# EasyEDA Pro project Revised_Schematic.epro

# Schematic Revised_Schematic_20261008

## Sheets
1 02_Power_Rails
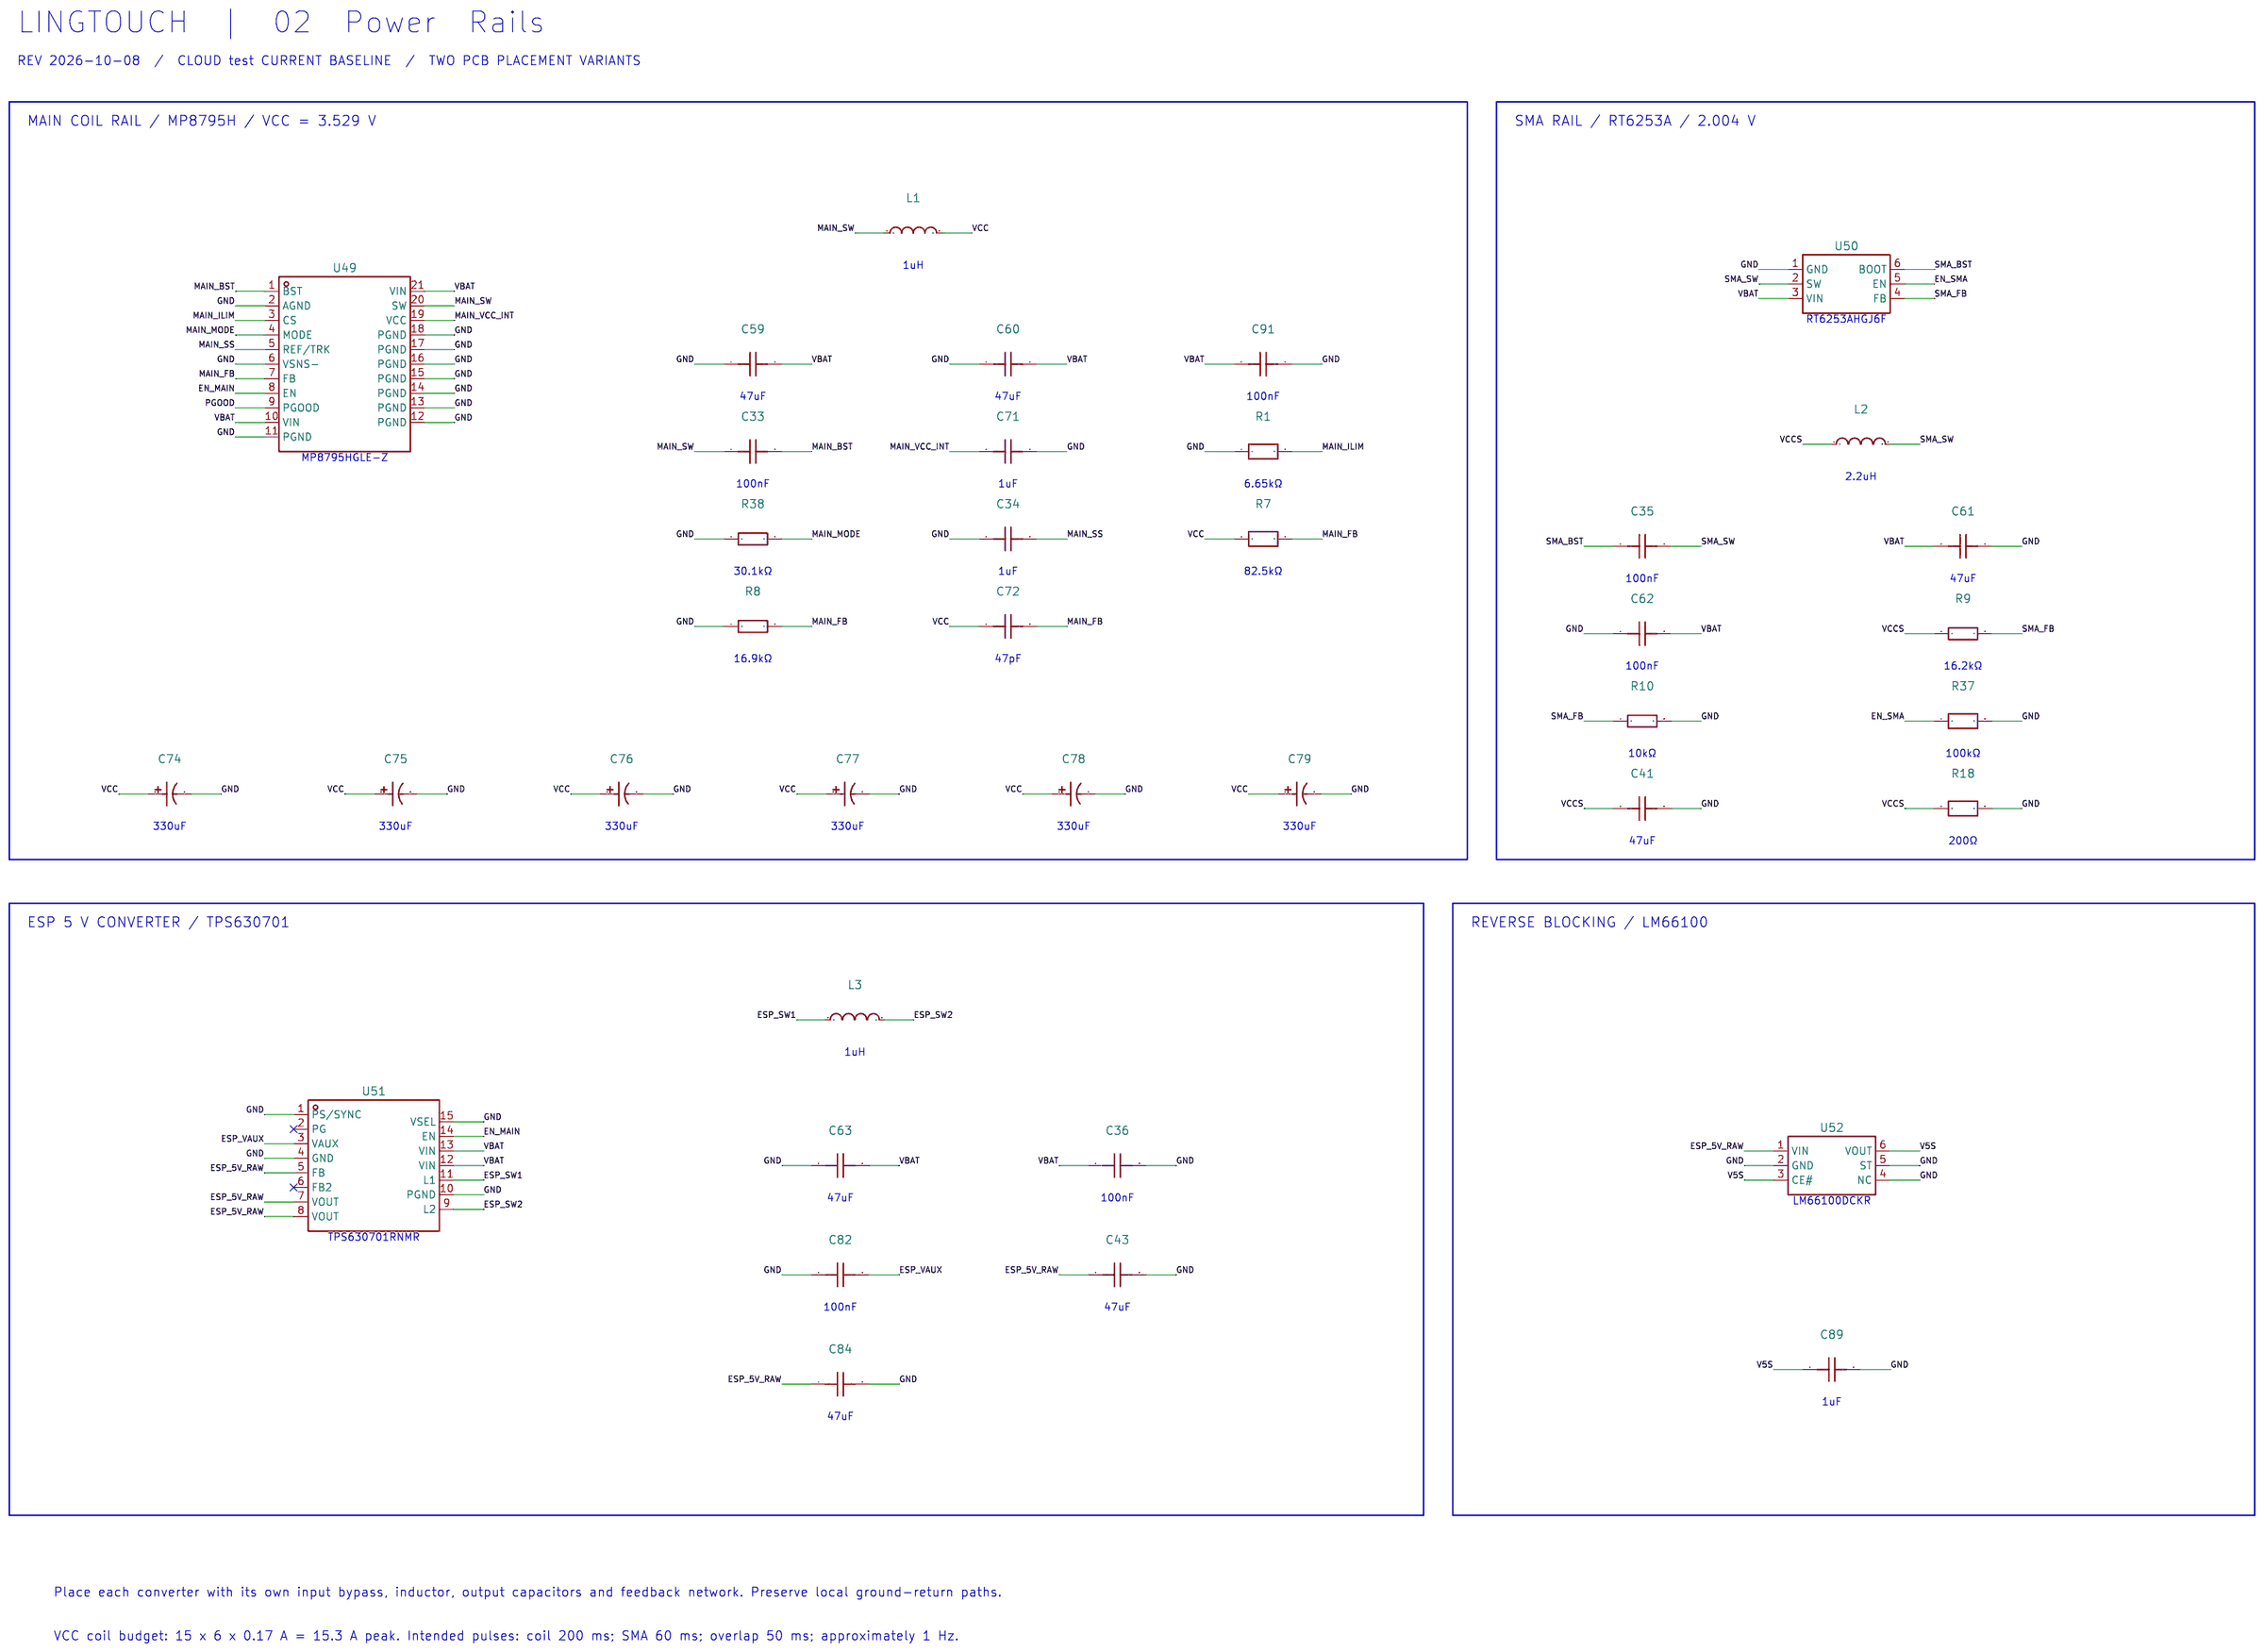
[diagram p0: 02_Power_Rails]
2 04_Drivers_01_08
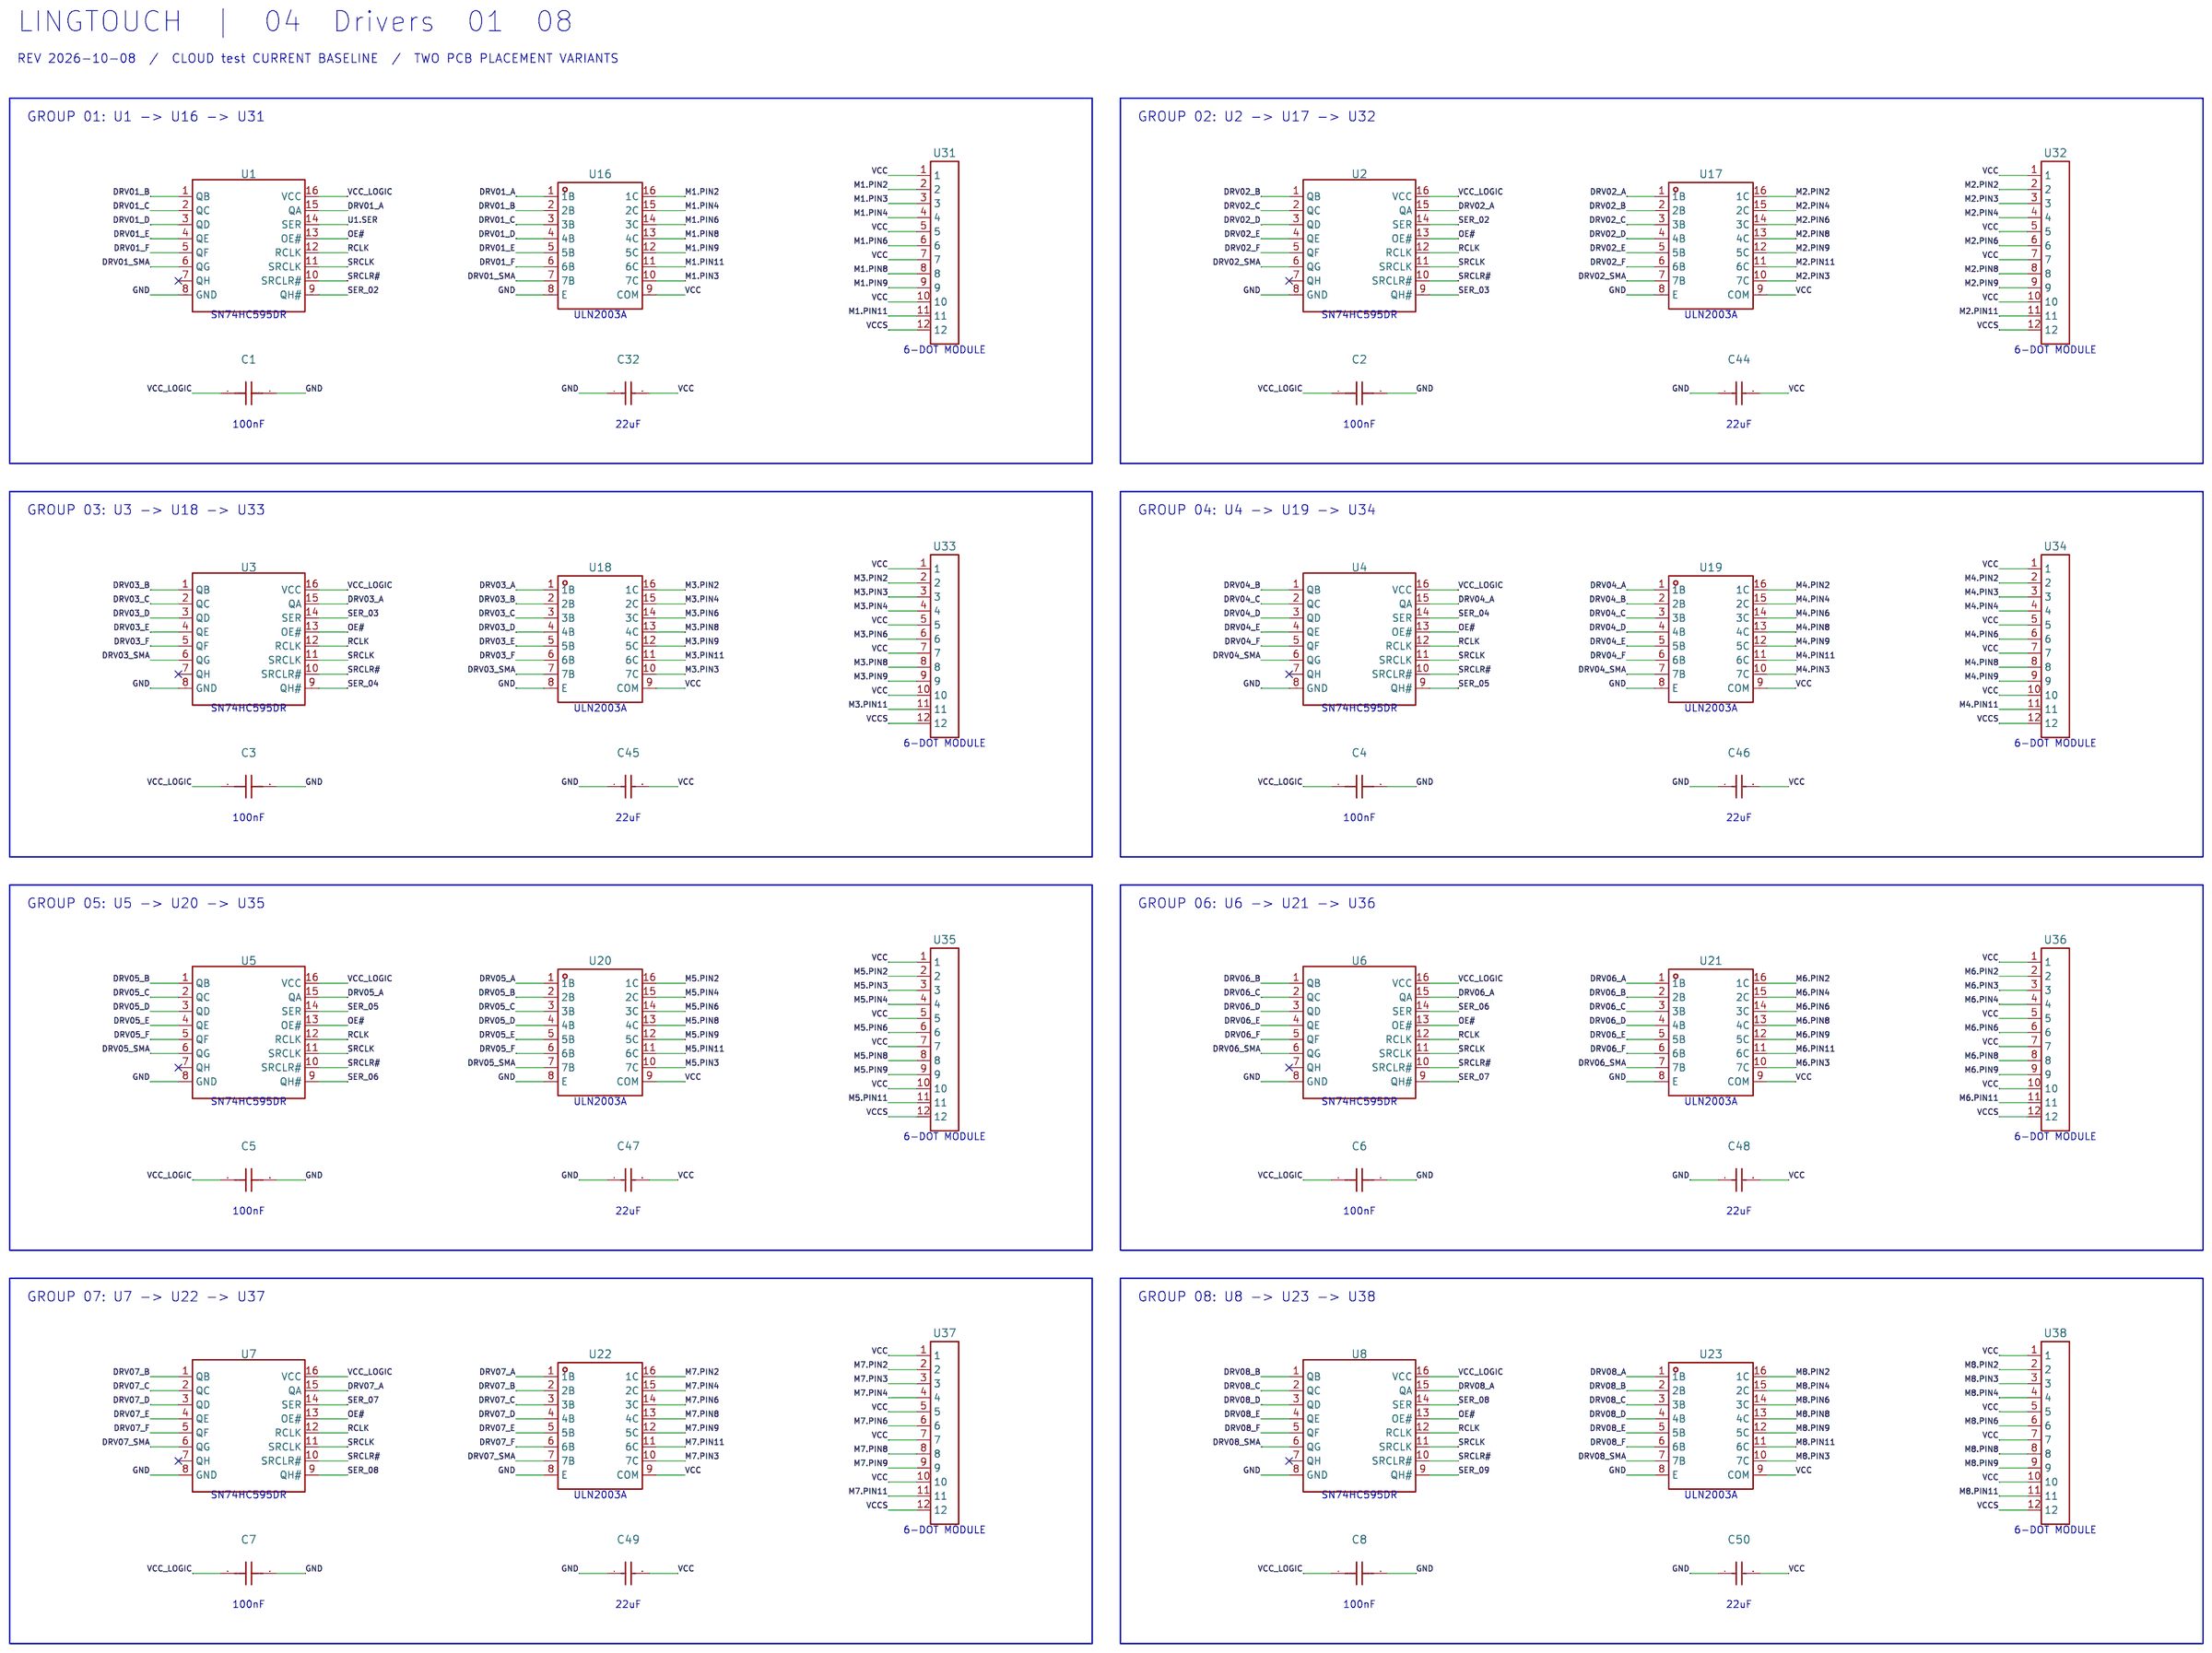
[diagram p1: 04_Drivers_01_08]
3 05_Drivers_09_16
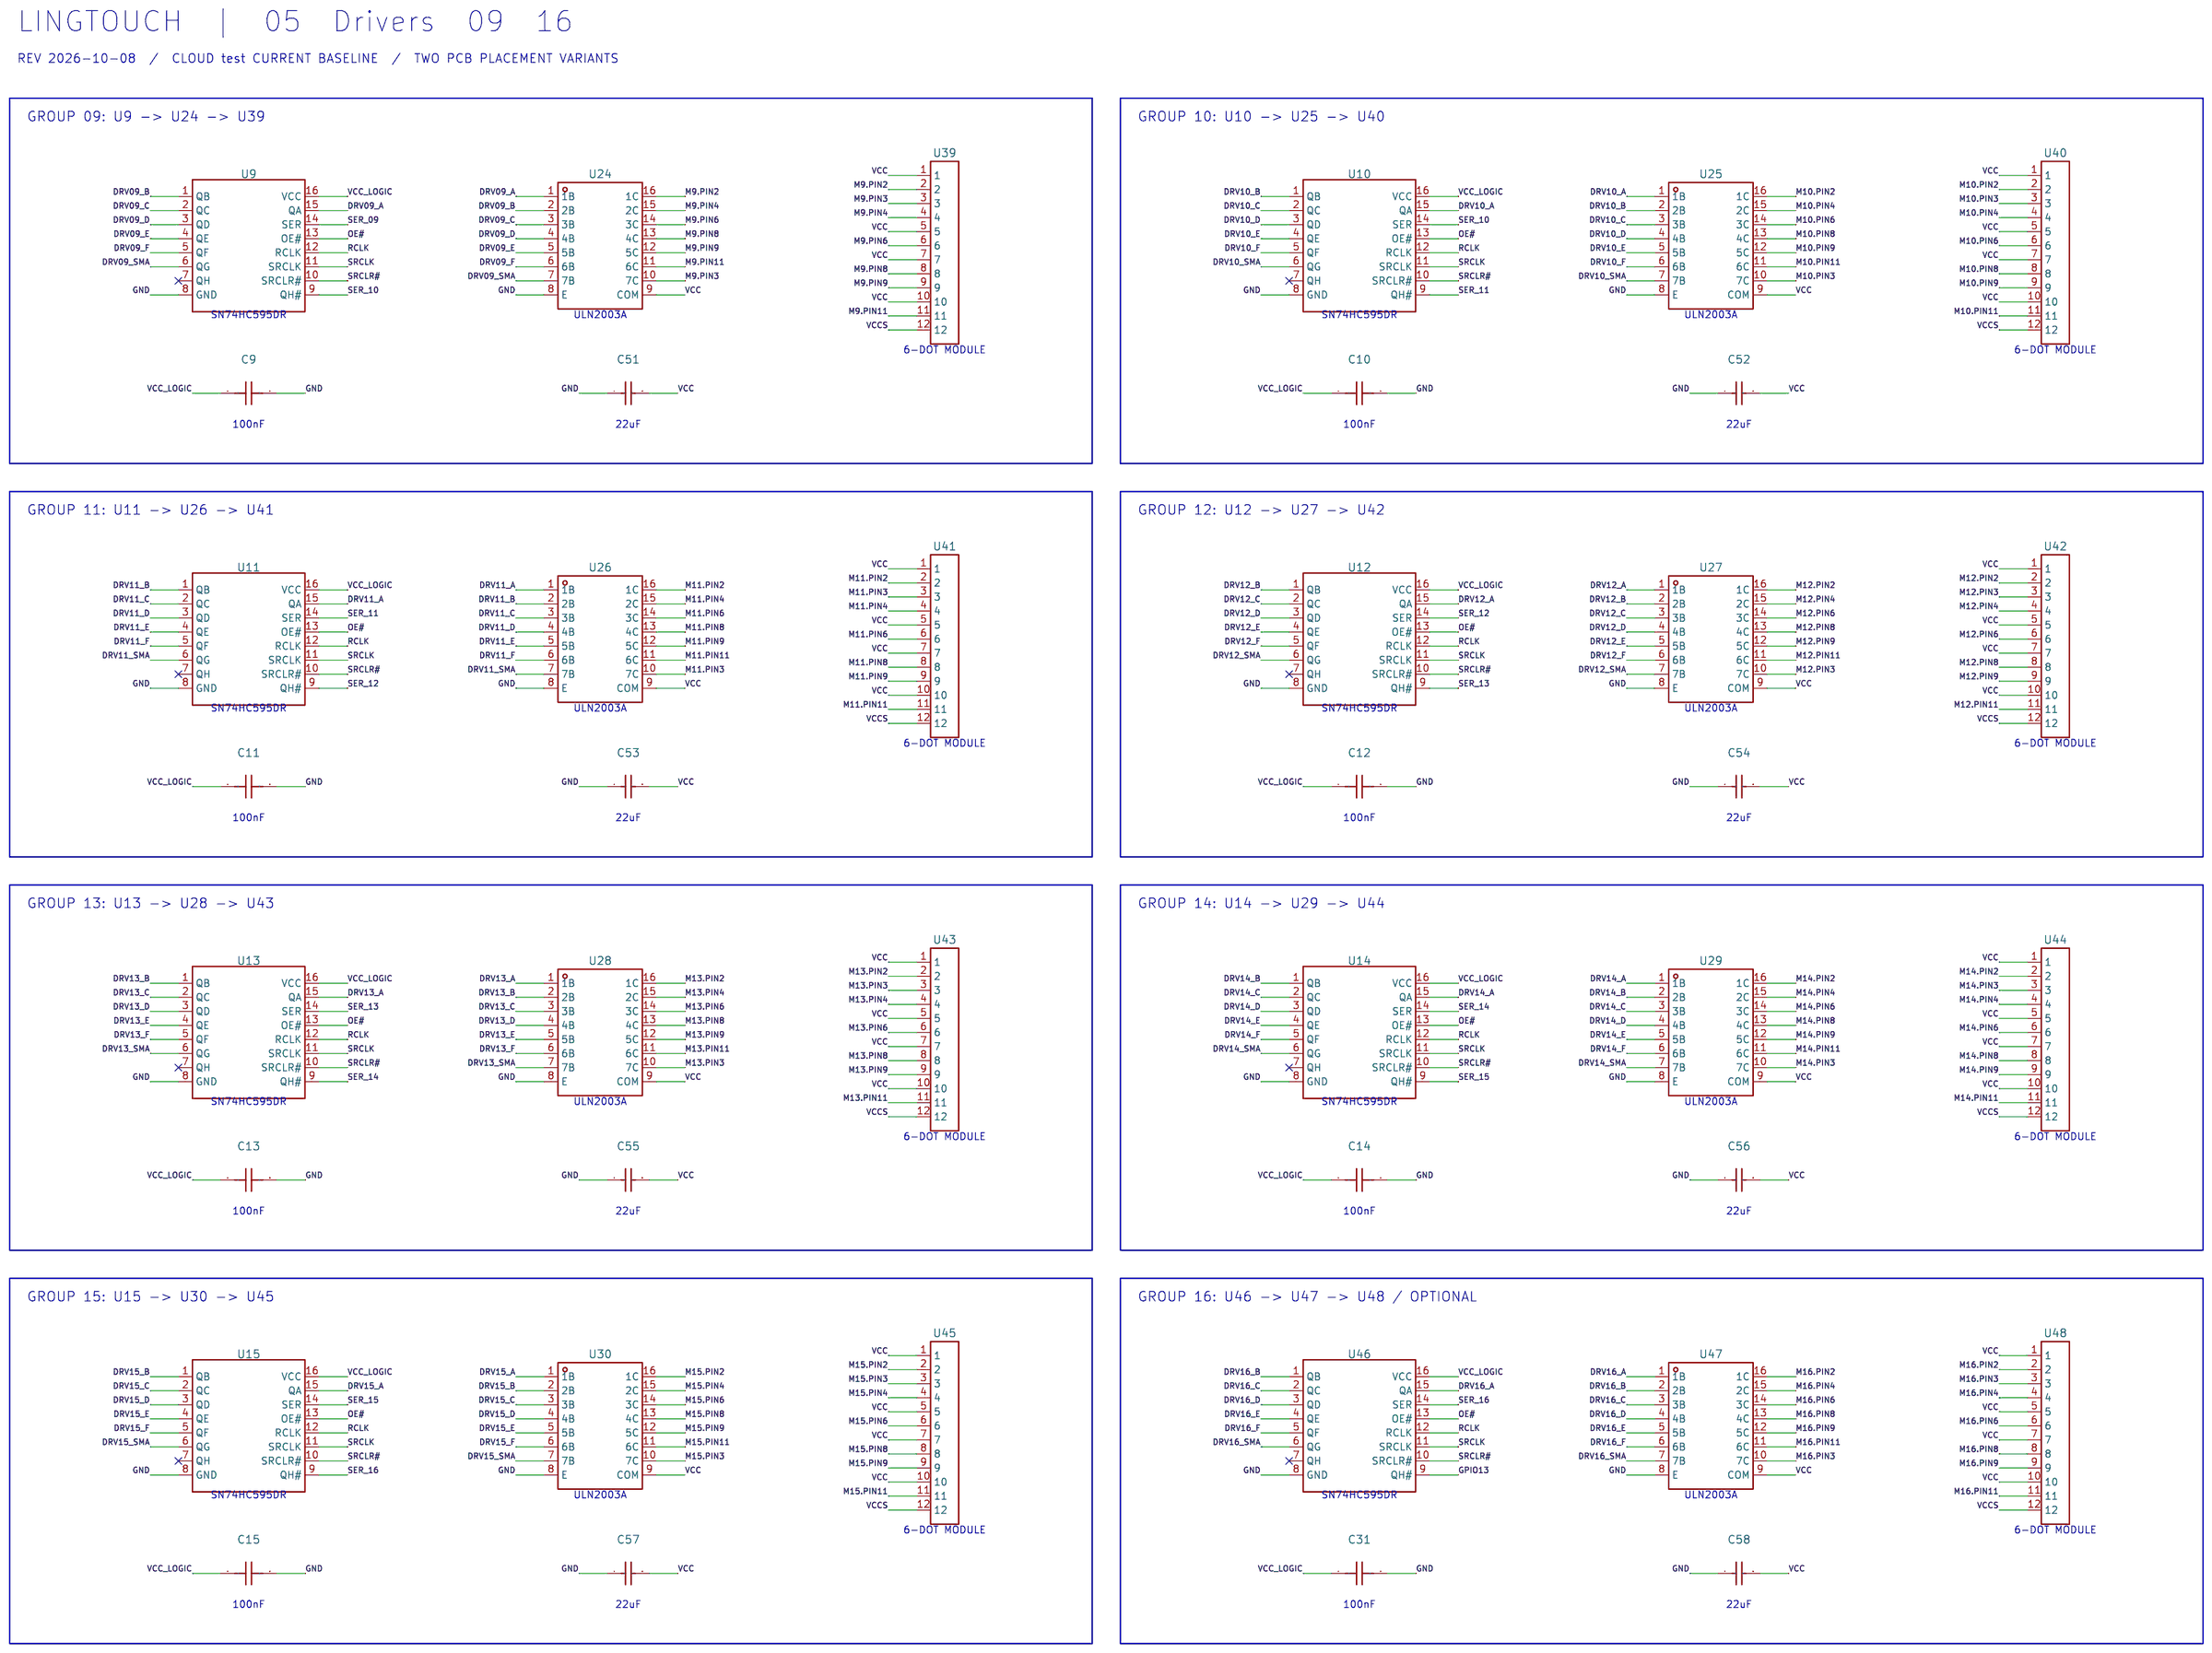
[diagram p2: 05_Drivers_09_16]
4 01_Input_Charging
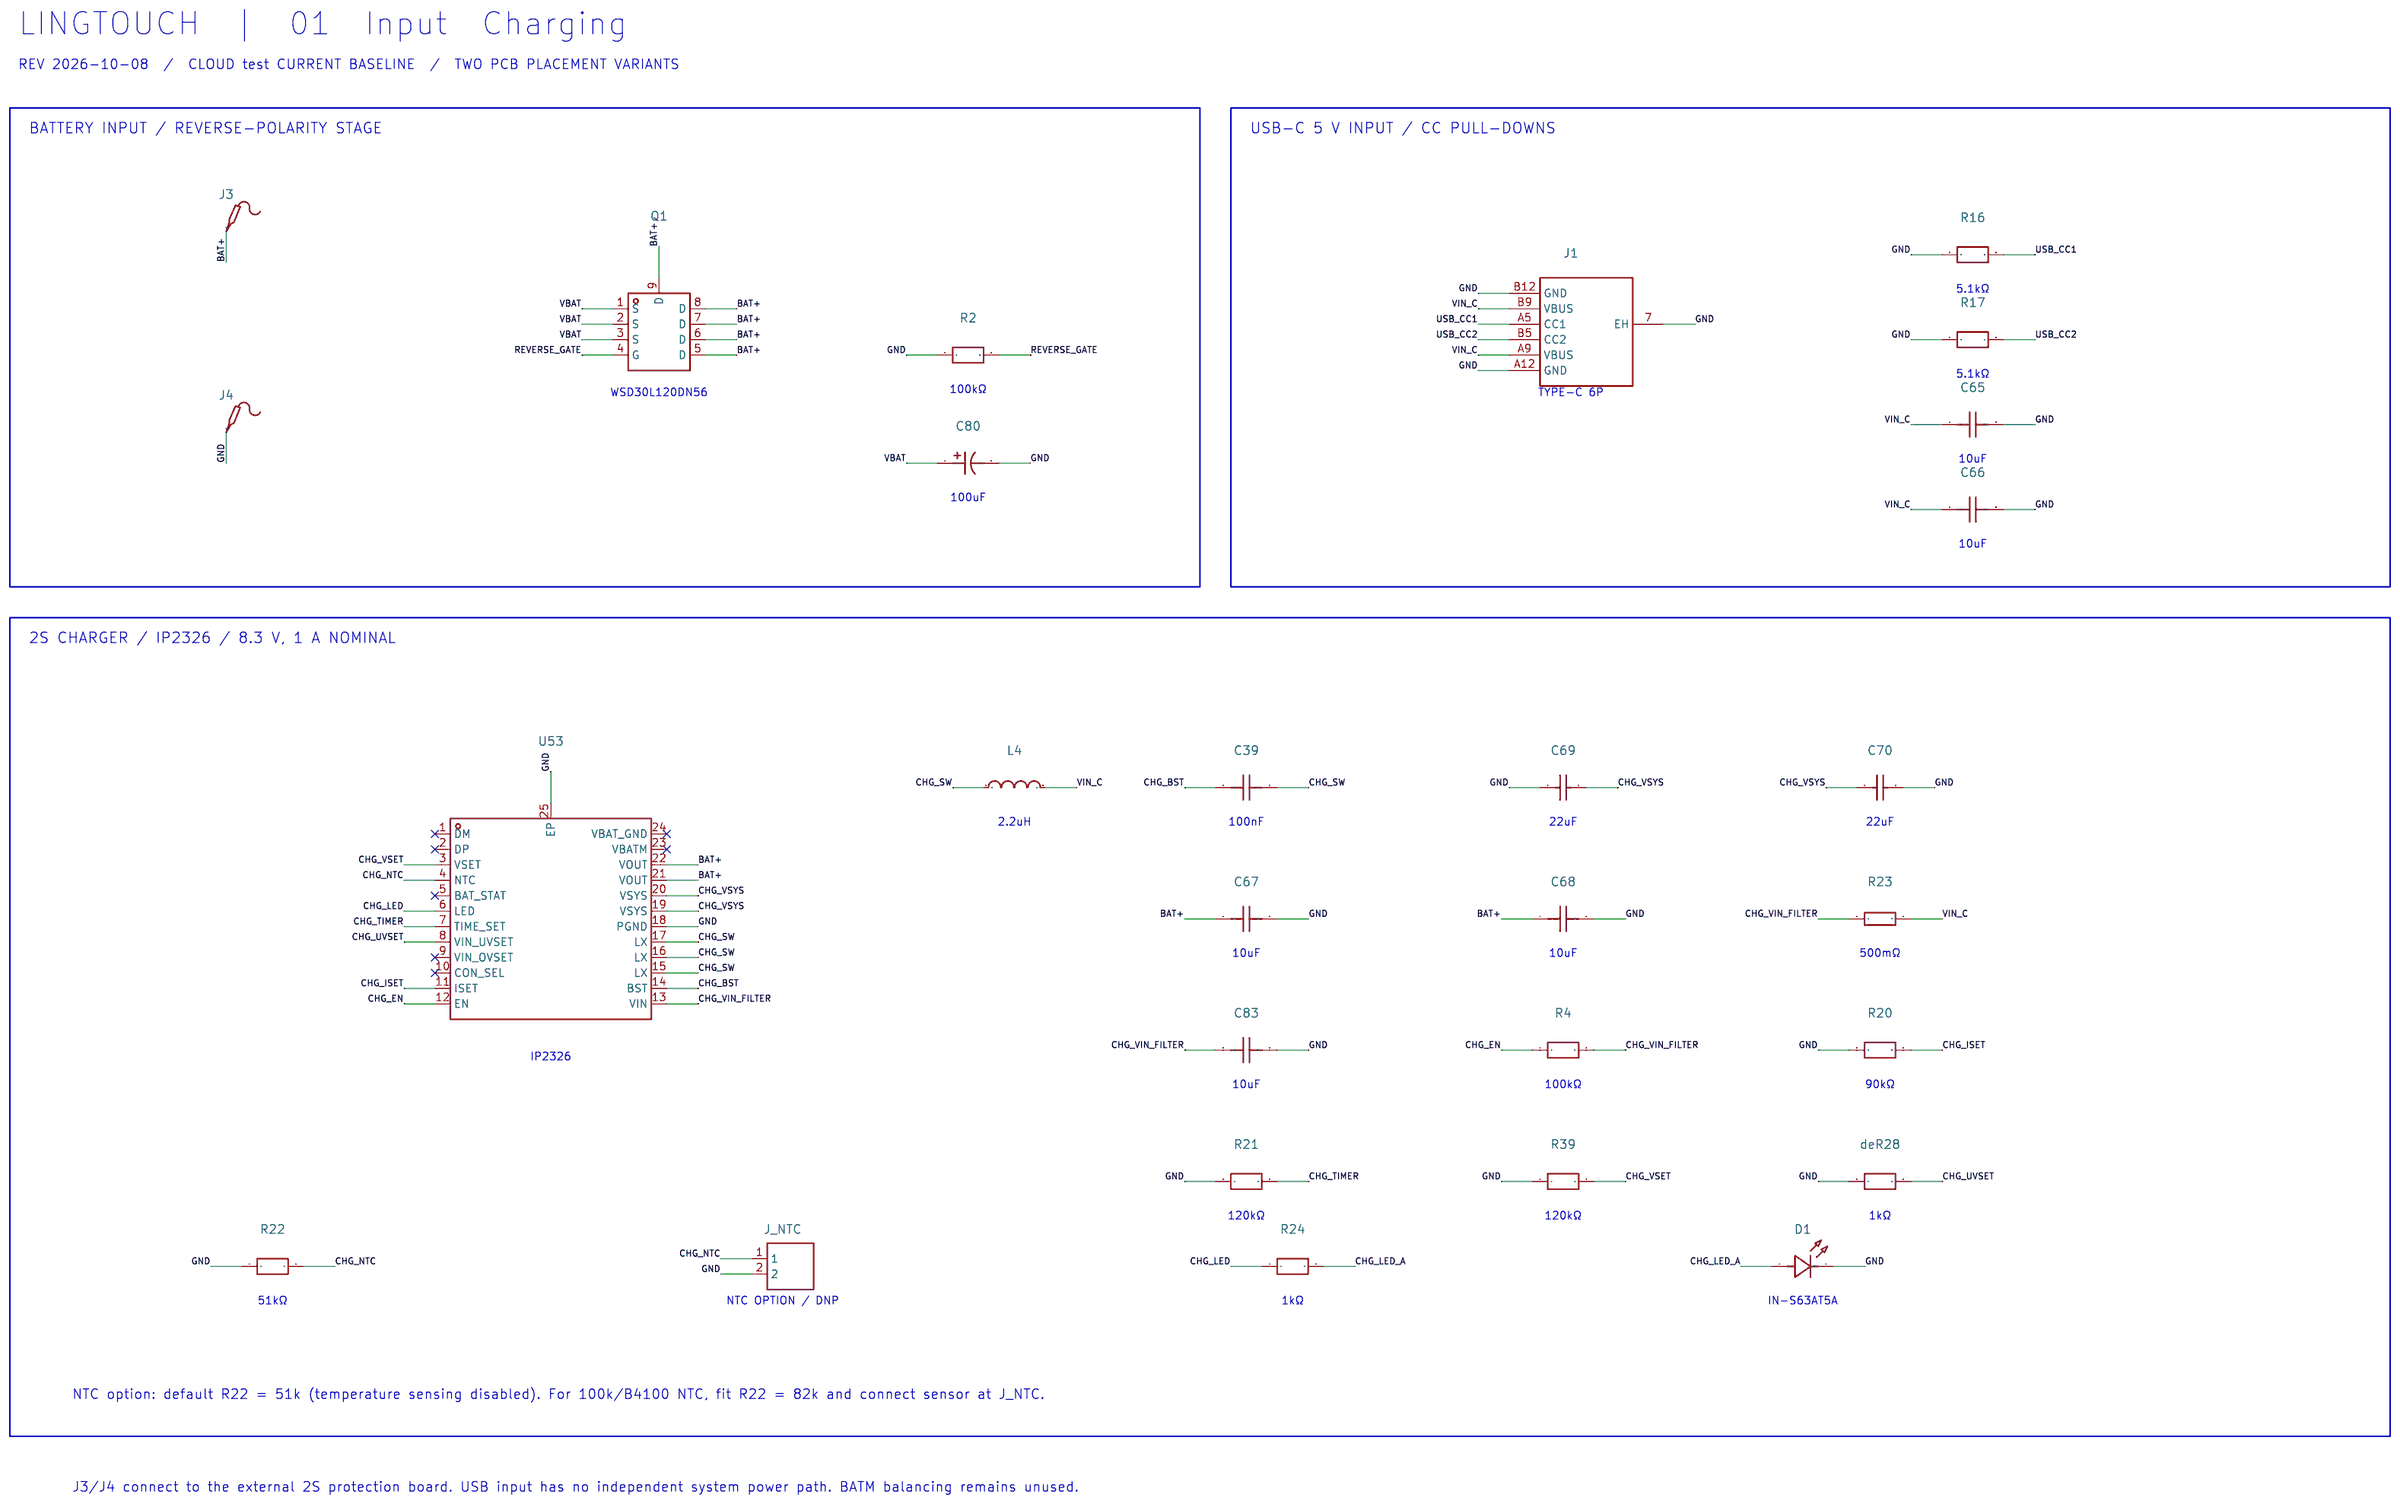
[diagram p3: 01_Input_Charging]
5 03_Control_ESP
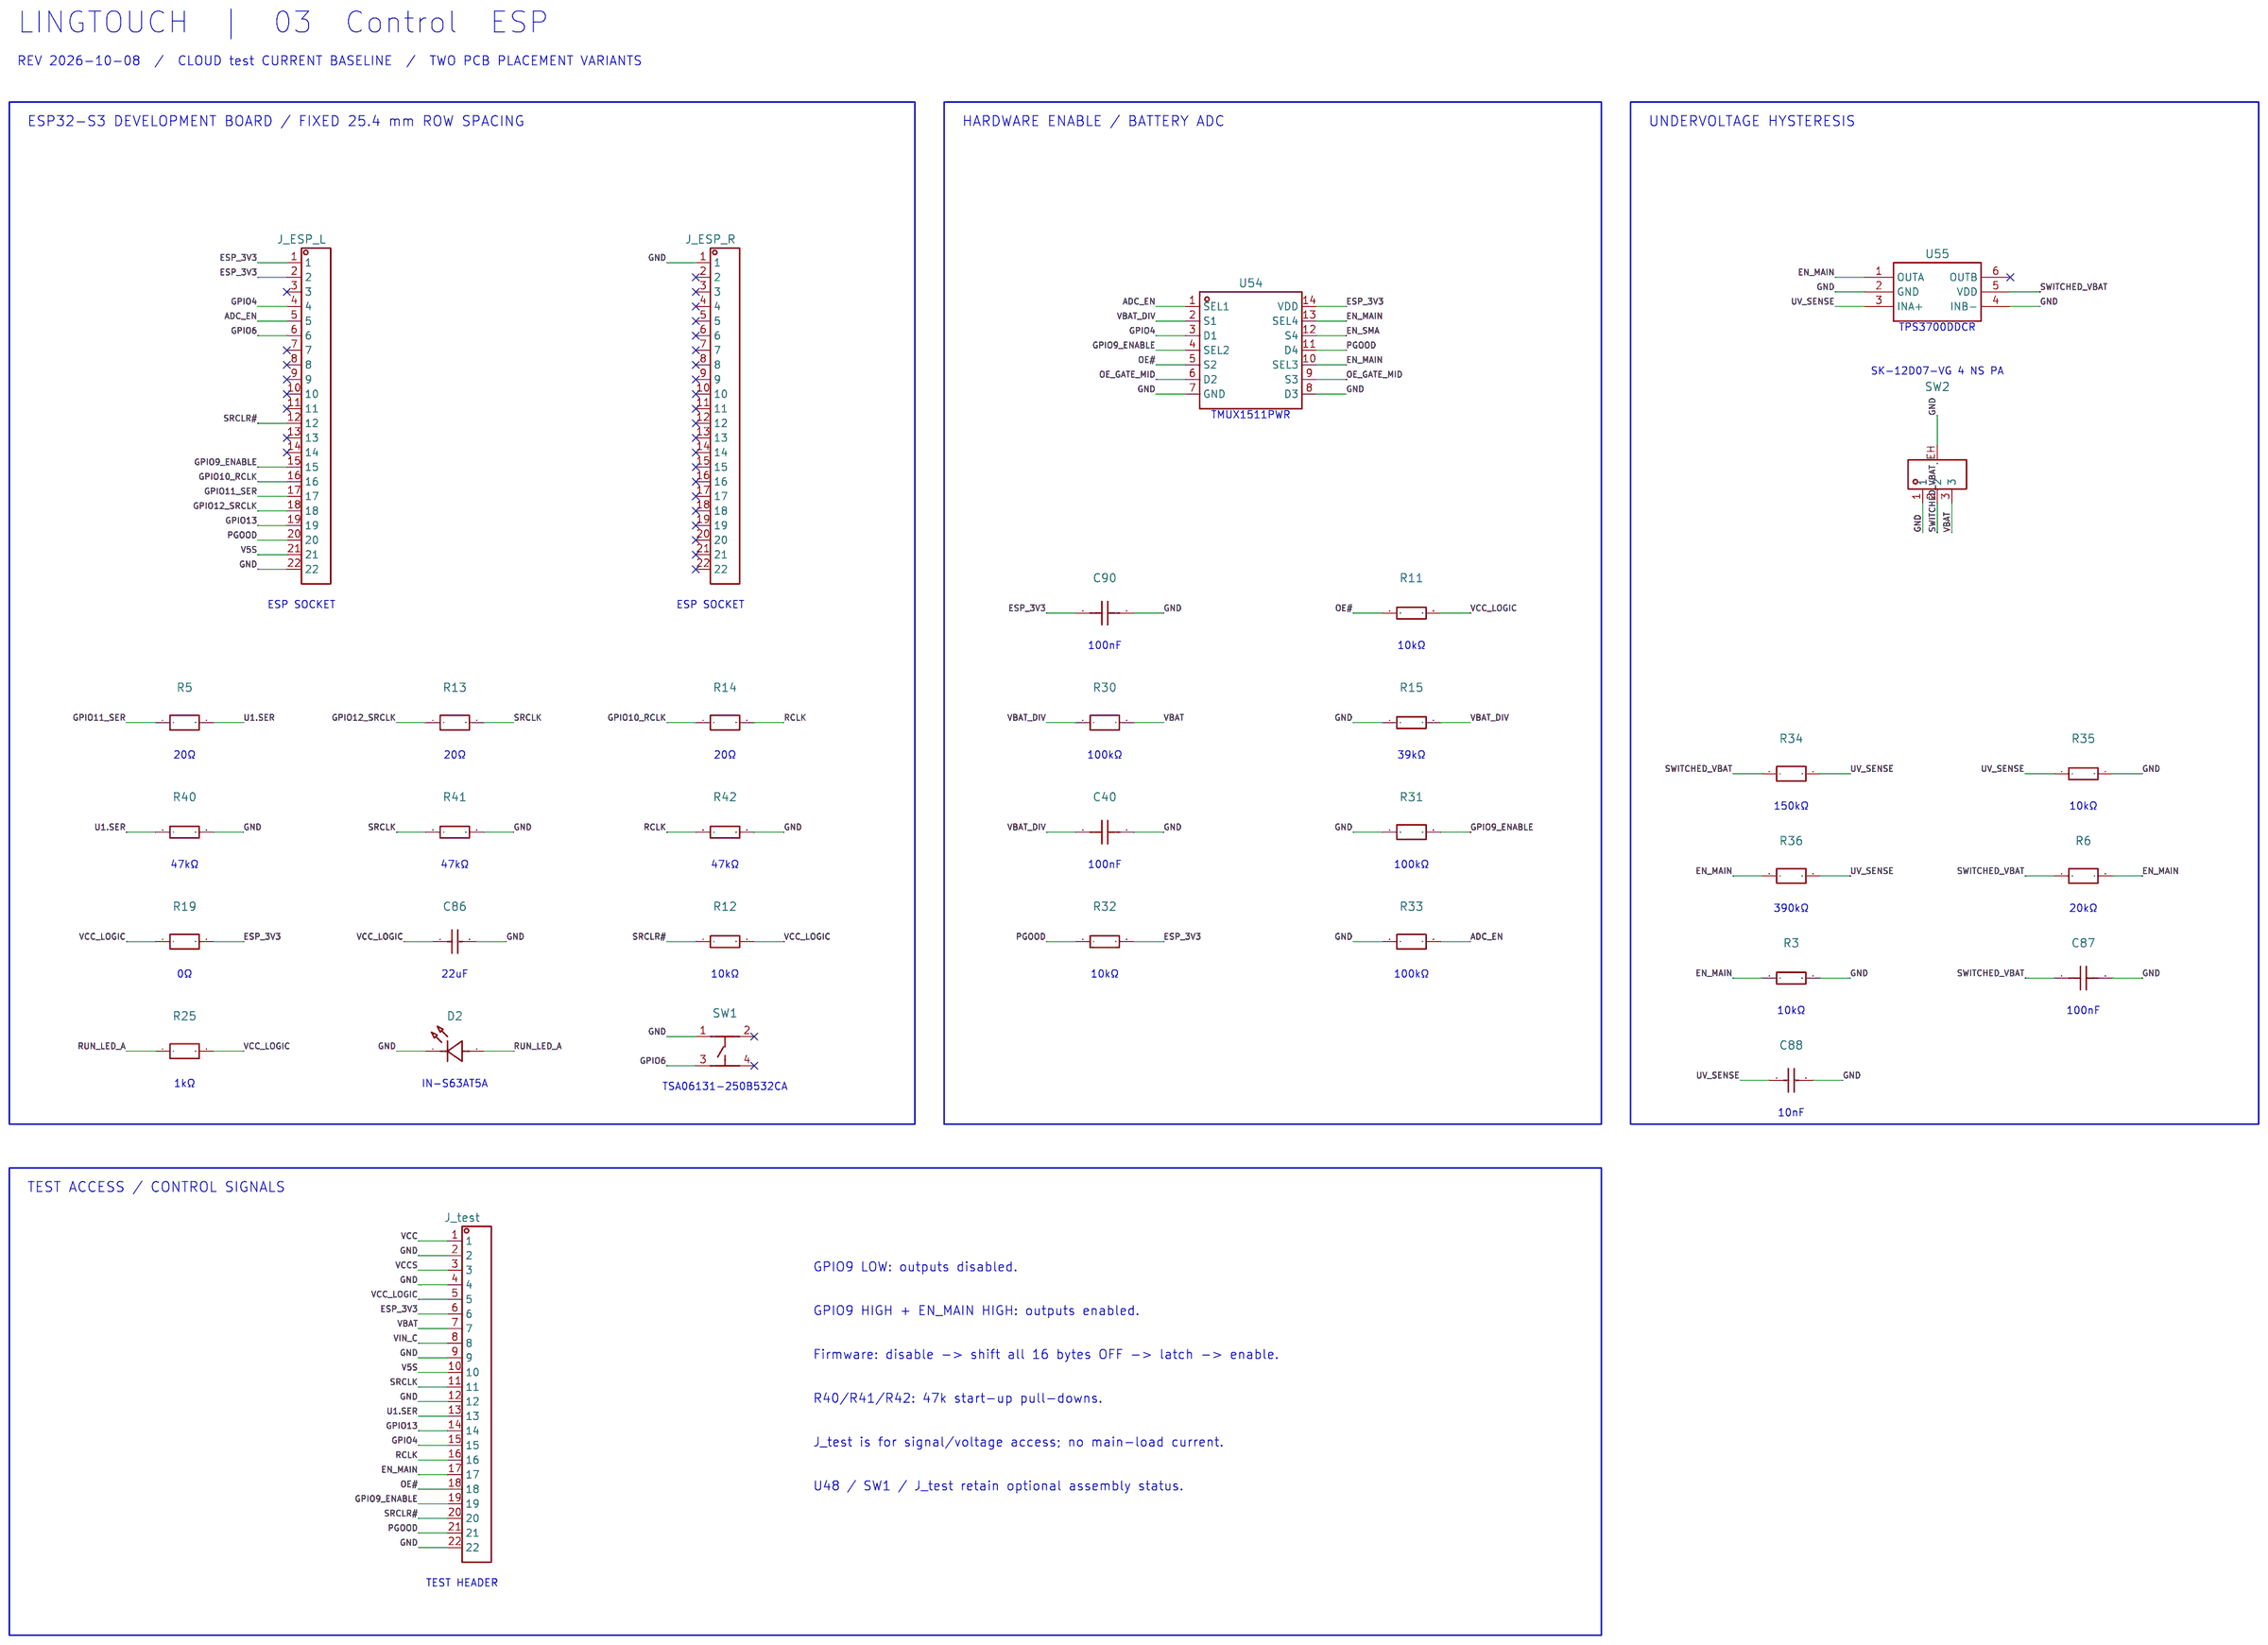
[diagram p4: 03_Control_ESP]

## Parts
sheet 01_Input_Charging
C39  100nF  [C0603]
C65  10uF  [C0805]
C66  10uF  [C0805]
C67  10uF  [C0805]
C68  10uF  [C0805]
C69  22uF  [C1206]
C70  22uF  [C1206]
C80  100uF  [CAP-SMD_BD6.3-L6.6-W6.6-LS7.2-FD]
C83  10uF  [C0805]
D1  IN-S63AT5A  [LED0603-RD]
deR28  1kΩ  [R0603]
J1  TYPE-C 6P  [TYPE-C-SMD_TYPE-C-6P_1]
J3  -  [Test-Point-0.5mm]
J4  -  [Test-Point-0.5mm]
J_NTC  B-2100S02P-A110  [HDR-TH_2P-P2.54-V-M-1]  (no BOM)
L4  2.2uH  [IND-SMD_L5.3-W5.1]
Q1  WSD30L120DN56  [POWERVDFN-8_L6.0-W5.0-P1.27-BL]
R2  100kΩ  [R0603]
R4  100kΩ  [R0603]
R16  5.1kΩ  [R0603]
R17  5.1kΩ  [R0603]
R20  90kΩ  [R0603]
R21  120kΩ  [R0603]
R22  51kΩ  [R0603]
R23  500mΩ  [R0603]
R24  1kΩ  [R0603]
R39  120kΩ  [R0603]
U53  IP2326  [VQFN-24_L4.0-W4.0-P0.50-BL-EP2.5]
sheet 02_Power_Rails
C33  100nF  [C0603]
C34  1uF  [C0603]
C35  100nF  [C0603]
C36  100nF  [C0603]
C41  47uF  [C1210]
C43  47uF  [C1210]
C59  47uF  [C1210]
C60  47uF  [C1210]
C61  47uF  [C1210]
C62  100nF  [C0603]
C63  47uF  [C1210]
C71  1uF  [C0603]
C72  47pF  [C0603]
C74  330uF  [CAP-SMD_BD6.3-L6.6-W6.6-FD]
C75  330uF  [CAP-SMD_BD6.3-L6.6-W6.6-FD]
C76  330uF  [CAP-SMD_BD6.3-L6.6-W6.6-FD]
C77  330uF  [CAP-SMD_BD6.3-L6.6-W6.6-FD]
C78  330uF  [CAP-SMD_BD6.3-L6.6-W6.6-FD]
C79  330uF  [CAP-SMD_BD6.3-L6.6-W6.6-FD]
C82  100nF  [C0603]
C84  47uF  [C1210]
C89  1uF  [C0603]
C91  100nF  [C0603]
L1  1uH  [IND-SMD_YSPI1365-1R0M]
L2  2.2uH  [IND-SMD_L5.3-W5.1]
L3  1uH  [IND-SMD_L5.4-W5.1_SPM5020T-100M-LR]
R1  6.65kΩ  [R0603]
R7  82.5kΩ  [R0603]
R8  16.9kΩ  [R0603]
R9  16.2kΩ  [R0603]
R10  10kΩ  [R0603]
R18  200Ω  [R0603]
R37  100kΩ  [R0603]
R38  30.1kΩ  [R0603]
U49  MP8795HGLE-Z  [TQFN-21_L4.0-W3.0-P0.40-TL_MPQ8633BGLE-Z]
U50  RT6253AHGJ6F  [TSOT-23-6_L2.9-W1.6-P0.95-LS2.8-BR]
U51  TPS630701RNMR  [VQFN-HR-15_L3.0-W2.5-P0.50-BL_TPS63070RNMR]
U52  LM66100DCKR  [SC-70-6_L2.0-W1.3-P0.65-LS2.1-BL]
sheet 03_Control_ESP
C40  100nF  [C0603]
C86  22uF  [C1206]
C87  100nF  [C0603]
C88  10nF  [C0603]
C90  100nF  [C0603]
D2  IN-S63AT5A  [LED0603-RD]
J_ESP_L  CS-1165SDIG-1*22  [HDR-TH_22P-P2.54-V-F]
J_ESP_R  CS-1165SDIG-1*22  [HDR-TH_22P-P2.54-V-F]
J_test  CS-1165SDIG-1*22  [HDR-TH_22P-P2.54-V-F]  (no BOM)
R3  10kΩ  [R0603]
R5  20Ω  [R0603]
R6  20kΩ  [R0603]
R11  10kΩ  [R0603]
R12  10kΩ  [R0603]
R13  20Ω  [R0603]
R14  20Ω  [R0603]
R15  39kΩ  [R0603]
R19  0Ω  [R0805]
R25  1kΩ  [R0603]
R30  100kΩ  [R0603]
R31  100kΩ  [R0603]
R32  10kΩ  [R0603]
R33  100kΩ  [R0603]
R34  150kΩ  [R0603]
R35  10kΩ  [R0603]
R36  390kΩ  [R0603]
R40  47kΩ  [R0603]
R41  47kΩ  [R0603]
R42  47kΩ  [R0603]
SW1  TSA06131-250B532CA  [SW-TH_4P-L6.1-W6.1-P4.50-LS6.5]  (no BOM)
SW2  SK-12D07-VG 4 NS PA  [SW-TH_SK-12D07-VG4-NS-PA]
U54  TMUX1511PWR  [TSSOP-14_L5.0-W4.4-P0.65-LS6.4-BL]
U55  TPS3700DDCR  [SOT-23-6_L2.9-W1.6-P0.95-LS2.8-BL]
sheet 04_Drivers_01_08
C1  100nF  [C0603]
C2  100nF  [C0603]
C3  100nF  [C0603]
C4  100nF  [C0603]
C5  100nF  [C0603]
C6  100nF  [C0603]
C7  100nF  [C0603]
C8  100nF  [C0603]
C32  22uF  [C1206]
C44  22uF  [C1206]
C45  22uF  [C1206]
C46  22uF  [C1206]
C47  22uF  [C1206]
C48  22uF  [C1206]
C49  22uF  [C1206]
C50  22uF  [C1206]
U1  SN74HC595DR  [SOIC-16_L9.9-W3.9-P1.27-LS6.0-BL]
U2  SN74HC595DR  [SOIC-16_L9.9-W3.9-P1.27-LS6.0-BL]
U3  SN74HC595DR  [SOIC-16_L9.9-W3.9-P1.27-LS6.0-BL]
U4  SN74HC595DR  [SOIC-16_L9.9-W3.9-P1.27-LS6.0-BL]
U5  SN74HC595DR  [SOIC-16_L9.9-W3.9-P1.27-LS6.0-BL]
U6  SN74HC595DR  [SOIC-16_L9.9-W3.9-P1.27-LS6.0-BL]
U7  SN74HC595DR  [SOIC-16_L9.9-W3.9-P1.27-LS6.0-BL]
U8  SN74HC595DR  [SOIC-16_L9.9-W3.9-P1.27-LS6.0-BL]
U16  ULN2003A  [SOP-16_L10.0-W3.9-P1.27-LS6.0-BL]
U17  ULN2003A  [SOP-16_L10.0-W3.9-P1.27-LS6.0-BL]
U18  ULN2003A  [SOP-16_L10.0-W3.9-P1.27-LS6.0-BL]
U19  ULN2003A  [SOP-16_L10.0-W3.9-P1.27-LS6.0-BL]
U20  ULN2003A  [SOP-16_L10.0-W3.9-P1.27-LS6.0-BL]
U21  ULN2003A  [SOP-16_L10.0-W3.9-P1.27-LS6.0-BL]
U22  ULN2003A  [SOP-16_L10.0-W3.9-P1.27-LS6.0-BL]
U23  ULN2003A  [SOP-16_L10.0-W3.9-P1.27-LS6.0-BL]
U31  HC-PM127-4.3H-1x12PZ  [module]
U32  HC-PM127-4.3H-1x12PZ  [module]
U33  HC-PM127-4.3H-1x12PZ  [module]
U34  HC-PM127-4.3H-1x12PZ  [module]
U35  HC-PM127-4.3H-1x12PZ  [module]
U36  HC-PM127-4.3H-1x12PZ  [module]
U37  HC-PM127-4.3H-1x12PZ  [module]
U38  HC-PM127-4.3H-1x12PZ  [module]
sheet 05_Drivers_09_16
C9  100nF  [C0603]
C10  100nF  [C0603]
C11  100nF  [C0603]
C12  100nF  [C0603]
C13  100nF  [C0603]
C14  100nF  [C0603]
C15  100nF  [C0603]
C31  100nF  [C0603]
C51  22uF  [C1206]
C52  22uF  [C1206]
C53  22uF  [C1206]
C54  22uF  [C1206]
C55  22uF  [C1206]
C56  22uF  [C1206]
C57  22uF  [C1206]
C58  22uF  [C1206]
U9  SN74HC595DR  [SOIC-16_L9.9-W3.9-P1.27-LS6.0-BL]
U10  SN74HC595DR  [SOIC-16_L9.9-W3.9-P1.27-LS6.0-BL]
U11  SN74HC595DR  [SOIC-16_L9.9-W3.9-P1.27-LS6.0-BL]
U12  SN74HC595DR  [SOIC-16_L9.9-W3.9-P1.27-LS6.0-BL]
U13  SN74HC595DR  [SOIC-16_L9.9-W3.9-P1.27-LS6.0-BL]
U14  SN74HC595DR  [SOIC-16_L9.9-W3.9-P1.27-LS6.0-BL]
U15  SN74HC595DR  [SOIC-16_L9.9-W3.9-P1.27-LS6.0-BL]
U24  ULN2003A  [SOP-16_L10.0-W3.9-P1.27-LS6.0-BL]
U25  ULN2003A  [SOP-16_L10.0-W3.9-P1.27-LS6.0-BL]
U26  ULN2003A  [SOP-16_L10.0-W3.9-P1.27-LS6.0-BL]
U27  ULN2003A  [SOP-16_L10.0-W3.9-P1.27-LS6.0-BL]
U28  ULN2003A  [SOP-16_L10.0-W3.9-P1.27-LS6.0-BL]
U29  ULN2003A  [SOP-16_L10.0-W3.9-P1.27-LS6.0-BL]
U30  ULN2003A  [SOP-16_L10.0-W3.9-P1.27-LS6.0-BL]
U39  HC-PM127-4.3H-1x12PZ  [module]
U40  HC-PM127-4.3H-1x12PZ  [module]
U41  HC-PM127-4.3H-1x12PZ  [module]
U42  HC-PM127-4.3H-1x12PZ  [module]
U43  HC-PM127-4.3H-1x12PZ  [module]
U44  HC-PM127-4.3H-1x12PZ  [module]
U45  HC-PM127-4.3H-1x12PZ  [module]
U46  SN74HC595DR  [SOIC-16_L9.9-W3.9-P1.27-LS6.0-BL]
U47  ULN2003A  [SOP-16_L10.0-W3.9-P1.27-LS6.0-BL]
U48  HC-PM127-4.3H-1x12PZ  [module]  (no BOM)

## Library data of the parts
C1-C15 C31 C33 C35 C36 C39 C40 C62 C82 C87 C90 C91 = CGA0603X7R104K500JT: 容值:100nF;精度:±10%;额定电压:50V;温度系数:X7R;; LCSC Part Name: 100nF ±10% 50V; Supplier Part: C6119867; Manufacturer: HRE(芯声); Supplier Footprint: 0603; JLCPCB Part Class: Extended Part; Datasheet: https://item.szlcsc.com/datasheet/CGA0603X7R104K500JT/7062573.html; Supplier: LCSC; Tolerance: ±10%; Voltage Rating: 50V; Temperature Coefficient: X7R
C65-C68 C83 = GRM21BR61E106KA73L: 容值:10uF;精度:±10%;额定电压:25V;温度系数:X5R;; LCSC Part Name: 10uF ±10% 25V; Supplier Part: C84416; Manufacturer: muRata(村田); Supplier Footprint: 0805; JLCPCB Part Class: Extended Part; Datasheet: https://item.szlcsc.com/datasheet/GRM21BR61E106KA73L/85586.html; Supplier: LCSC; Tolerance: ±10%; Voltage Rating: 25V; Temperature Coefficient: X5R
C32 C44-C58 C69 C70 C86 = GRM31CR61E226KE15L: 容值:22uF;精度:±10%;额定电压:25V;温度系数:X5R;; LCSC Part Name: 22uF ±10% 25V; Supplier Part: C77091; Manufacturer: muRata(村田); Supplier Footprint: 1206; JLCPCB Part Class: Extended Part; Datasheet: https://item.szlcsc.com/datasheet/GRM31CR61E226KE15L/78218.html; Supplier: LCSC; Tolerance: ±10%; Voltage Rating: 25V; Temperature Coefficient: X5R
C80 = RVT100UF16V67RV0016: 容值:100uF;精度:±20%;额定电压:16V;纹波电流:93mA@120Hz;等效串联电阻(ESR):-;; LCSC Part Name: 100uF ±20% 16V; Supplier Part: C2887276; Manufacturer: KNSCHA(科尼盛); Supplier Footprint: SMD,D6.3xL5.4mm; JLCPCB Part Class: Extended Part; Datasheet: https://item.szlcsc.com/datasheet/RVT100UF16V67RV0016/3103844.html; Supplier: LCSC; Tolerance: ±20%; Voltage Rating: 16V; Ripple Current: 93mA@120Hz; Diameter: 6.3mm; Height - Seated (Max): 5.4mm; Lifetime: 2000hrs@105℃; Operating Temperature: -55℃~+105℃
D1 D2 = IN-S63AT5A: 灯头类型:-;发光颜色:琥珀色;正向压降(Vf):2V;功率:75mW;正向电流:5mA;波长:605nm;二极管配置:独立二极管;透镜颜色:无色透明透镜;色温:-;发光强度:35mcd;发光角度:120°;载带方式:-;工作温度:-40℃~+85℃;; LCSC Part Name: 顶视0603贴片式LED，PCB型; Supplier Part: C5656657; Manufacturer: Inolux; Supplier Footprint: 0603; JLCPCB Part Class: Extended Part; Datasheet: https://item.szlcsc.com/datasheet/IN-S63AT5A/6577612.html; Supplier: LCSC; Illumination Color: 琥珀色; Voltage - Forward(Vf): 2V; Power(Watts): 75mW; Forward Current: 5mA; Wavelength - Dominant: 605nm; Peak Wavelength: 609nm; Diode Configuration: 独立二极管; Lens Color: 无色透明透镜; Luminous Intensity: 35mcd; Viewing Angle: 120°; Operating Temperature: -40℃~+85℃
deR28 R24 R25 = RCA031KFLF: 电阻类型:厚膜电阻;阻值:1kΩ;精度:±1%;功率:100mW;工作电压:75V;温度系数:±100ppm/℃;; LCSC Part Name: 1kΩ ±1% 100mW; Supplier Part: C22356461; Manufacturer: HKR(香港电阻); Supplier Footprint: 0603; JLCPCB Part Class: Extended Part; Datasheet: https://item.szlcsc.com/datasheet/RCA031KFLF/23789905.html; Supplier: LCSC; Type: 厚膜电阻; Tolerance: ±1%; Power(Watts): 100mW; Voltage-Supply(Max): 75V; Temperature Coefficient: ±100ppm/℃; Operating Temperature: -55℃~+155℃
J1 = TYPE-C 6P: 连接器类型:Type-C;协议标准:-;公母:母;安装方式:卧贴;触点数量:6P;端口数量:1;额定电流 - 电源:3A;工作温度:-40℃~+85℃;; LCSC Part Name: 6P卧贴母座; Supplier Part: C456012; Manufacturer: SHOU HAN(首韩); Supplier Footprint: SMD; JLCPCB Part Class: Extended Part; Datasheet: https://item.szlcsc.com/datasheet/TYPE-C%25206P/458819.html; Supplier: LCSC; Connector Type: Type-C; Gender: 母; Mounting Type: 卧贴; Number of Contacts: 6P; Number of Ports: 1; Current Rating-Power: 3A; Voltage Rating: 5V; Connect-Disconnect Life: 3千次; Detection color: 黑色; Operating Temperature: -40℃~+85℃
J3 J4 = Test-Point: Test Point 测试点
J_NTC = B-2100S02P-A110: 插针结构:1x2P;间距:2.54mm;行距:-;圆针/方针:方针;安装方式:直插;排数:单排;总PIN位数:2P;额定电流:3A;额定电压:-;配合针长度:6mm;塑高:2.54mm;端接针长度:3mm;触头材质:黄铜;触头镀层:金;工作温度:-40℃~+105℃;颜色:黑色;; LCSC Part Name: 1x2P 间距:2.54mm 方针 直插; Supplier Part: C124375; Manufacturer: Ckmtw(灿科盟); Supplier Footprint: 插件,P=2.54mm; JLCPCB Part Class: Extended Part; Datasheet: https://item.szlcsc.com/datasheet/B-2100S02P-A110/125650.html; Supplier: LCSC; Pin Structure: 1x2P; Pitch: 2.54mm; Circluar Pins/Square Pins: 方针; Mounting Type: 直插; Number of Rows: 单排; Number of Pins: 2P; Current Rating: 3A; Length of Mating Pin: 6mm; Insulation Height: 2.54mm; Length of End Connection Pin: 3mm; Contact Material: 黄铜; Contact Plating: 金; Operating Temperature: -40℃~+105℃; Color: 黑色; PCB Layer: Default
L2 L4 = SPM5030VT-2R2M-D: 电感值:2.2uH;精度:±20%;额定电流:6.6A;饱和电流(Isat):9A;; LCSC Part Name: 2.2uH ±20% 9A; Supplier Part: C1512763; Manufacturer: TDK; Supplier Footprint: SMD,5.3x5.1mm; JLCPCB Part Class: Extended Part; Datasheet: https://atta.szlcsc.com/upload/public/pdf/source/20210531/837B32BAD25F21C9DA0B0CC5FCCCCAFC.pdf; Supplier: LCSC; Tolerance: ±20%; Rated Current: 6.6A; Saturation Current (Isat): 9A; DC Resistance (DCR): 20mΩ; Ratings: AEC-Q200
Q1 = WSD30L120DN56: 数量:1个P沟道;漏源电压(Vdss):30V;连续漏极电流(Id):120A;导通电阻(RDS(on)):6.8mΩ@4.5V;耗散功率(Pd):78W;阈值电压(Vgs(th)):2.5V;; LCSC Part Name: 1个P沟道 耐压:30V 电流:120A; Supplier Part: C148396; Manufacturer: WINSOK(微硕); Supplier Footprint: DFN5X6-8; JLCPCB Part Class: Extended Part; Datasheet: https://item.szlcsc.com/datasheet/WSD30L120DN56/159729.html; Supplier: LCSC; Number: 1个P沟道; Drain to Source Voltage: 30V; Current - Continuous Drain(Id): 120A; RDS(on): 6.8mΩ@4.5V; Pd - Power Dissipation: 78W; Gate Threshold Voltage (Vgs(th)): 2.5V; Gate Charge(Qg): 135nC@10V; Input Capacitance(Ciss): 6.1nF; Reverse Transfer Capacitance (Crss@Vds): 1.11nF; Operating Temperature: -55℃~+150℃; Type: P沟道; Output Capacitance(Coss): 1.13nF; Vgs: ±20V
R2 R4 R30 R31 R33 R37 = RCA03100KFLF: 电阻类型:厚膜电阻;阻值:100kΩ;精度:±1%;功率:100mW;工作电压:75V;温度系数:±100ppm/℃;; LCSC Part Name: 100kΩ ±1% 100mW; Supplier Part: C22369815; Manufacturer: HKR(香港电阻); Supplier Footprint: 0603; JLCPCB Part Class: Extended Part; Datasheet: https://item.szlcsc.com/datasheet/RCA03100KFLF/23848846.html; Supplier: LCSC; Type: 厚膜电阻; Tolerance: ±1%; Power(Watts): 100mW; Voltage-Supply(Max): 75V; Temperature Coefficient: ±100ppm/℃; Operating Temperature: -55℃~+155℃
R16 R17 = RCA035K1FLF: 电阻类型:厚膜电阻;阻值:5.1kΩ;精度:±1%;功率:100mW;工作电压:75V;温度系数:±100ppm/℃;; LCSC Part Name: 5.1kΩ ±1% 100mW; Supplier Part: C22356467; Manufacturer: HKR(香港电阻); Supplier Footprint: 0603; JLCPCB Part Class: Extended Part; Datasheet: https://item.szlcsc.com/datasheet/RCA035K1FLF/23789911.html; Supplier: LCSC; Type: 厚膜电阻; Tolerance: ±1%; Power(Watts): 100mW; Voltage-Supply(Max): 75V; Temperature Coefficient: ±100ppm/℃; Operating Temperature: -55℃~+155℃
R20 = 0603WAF9002T5E: 电阻类型:厚膜电阻;阻值:90kΩ;精度:±1%;功率:100mW;最大工作电压:75V;温度系数:±100ppm/℃;; LCSC Part Name: 90kΩ ±1% 100mW 厚膜电阻; Supplier Part: C2767219; Manufacturer: UNI-ROYAL(厚声); Supplier Footprint: 0603; JLCPCB Part Class: Extended Part; Datasheet: https://atta.szlcsc.com/upload/public/pdf/source/20200306/C422600_1E6D84923E4A46A82E41ADD87F860B5C.pdf; Supplier: LCSC; Type: 厚膜电阻; Tolerance: ±1%; Power(Watts): 100mW; Overload Voltage (Max): 75V; Temperature Coefficient: ±100ppm/℃; Operating Temperature Range: -55℃~+155℃
R21 R39 = RCA03120KFLF: 电阻类型:厚膜电阻;阻值:120kΩ;精度:±1%;功率:100mW;工作电压:75V;温度系数:±100ppm/℃;; LCSC Part Name: 120kΩ ±1% 100mW; Supplier Part: C22356447; Manufacturer: HKR(香港电阻); Supplier Footprint: 0603; JLCPCB Part Class: Extended Part; Datasheet: https://item.szlcsc.com/datasheet/RCA03120KFLF/23789891.html; Supplier: LCSC; Type: 厚膜电阻; Tolerance: ±1%; Power(Watts): 100mW; Voltage-Supply(Max): 75V; Temperature Coefficient: ±100ppm/℃; Operating Temperature: -55℃~+155℃
R22 = RCA0351KFLF: 电阻类型:厚膜电阻;阻值:51kΩ;精度:±1%;功率:100mW;工作电压:75V;温度系数:±100ppm/℃;; LCSC Part Name: 51kΩ ±1% 100mW; Supplier Part: C22369785; Manufacturer: HKR(香港电阻); Supplier Footprint: 0603; JLCPCB Part Class: Extended Part; Datasheet: https://item.szlcsc.com/datasheet/RCA0351KFLF/23848816.html; Supplier: LCSC; Type: 厚膜电阻; Tolerance: ±1%; Power(Watts): 100mW; Voltage-Supply(Max): 75V; Temperature Coefficient: ±100ppm/℃; Operating Temperature: -55℃~+155℃
R23 = RL0603FR-070R5L: 电阻类型:厚膜电阻;阻值:500mΩ;精度:±1%;功率:100mW;温度系数:±800ppm/℃;; LCSC Part Name: 厚膜电阻 500mΩ ±1% 100mW; Supplier Part: C309622; Manufacturer: YAGEO(国巨); Supplier Footprint: 0603; JLCPCB Part Class: Extended Part; Datasheet: https://atta.szlcsc.com/upload/public/pdf/source/20181010/C314696_9145FE4B7C432DAFC4F58E6DCB1BC03E.pdf; Supplier: LCSC; Type: 厚膜电阻; Tolerance: ±1%; Power(Watts): 100mW; Temperature Coefficient: ±800ppm/℃
U53 = IP2326: 工作电压:4.5V~9.5V;最大充电电流:1.5A;电池类型:锂电池;电池节数:2~3;; LCSC Part Name: 支持15W快充的2节/3节串联锂电池升压充电IC; Supplier Part: C2832094; Manufacturer: INJOINIC(英集芯); Supplier Footprint: VQFN-24-EP(4x4); JLCPCB Part Class: Extended Part; Datasheet: https://item.szlcsc.com/datasheet/IP2326/2988389.html; Supplier: LCSC; The Chip Type: 充电芯片；均衡芯片; Voltage - Supply: 4.5V~9.5V; Charge Current - Max: 1.5A; Charging Saturation Voltage: 8.4V; Type of Battery: 锂电池; Number of Cells: 2~3; Operating Temperature: -40℃~+150℃; Battery Temperature Detection: 支持; Supply Current (Iq): 700nA; Features: 过流保护；恒压充电；恒流充电；电芯均衡；自动再充电；充电终止；可编程充电电流；过压保护；欠压锁定；涓流充电
C34 C71 C89 = FCC0603B105K160CT: 容值:1uF;精度:±10%;额定电压:16V;温度系数:X7R;; LCSC Part Name: 1uF ±10% 16V; Supplier Part: C7419418; Manufacturer: FOJAN(富捷); Supplier Footprint: 0603; JLCPCB Part Class: Extended Part; Datasheet: https://item.szlcsc.com/datasheet/FCC0603B105K160CT/8393400.html; Supplier: LCSC; Tolerance: ±10%; Voltage Rating: 16V; Temperature Coefficient: X7R; Operating Temperature: -55℃~+125℃
C41 C43 C59-C61 C63 C84 = GRM32ER61C476KE15L: 容值:47uF;精度:±10%;额定电压:16V;温度系数:X5R;; LCSC Part Name: 47uF ±10% 16V; Supplier Part: C77101; Manufacturer: muRata(村田); Supplier Footprint: 1210; JLCPCB Part Class: Extended Part; Datasheet: https://item.szlcsc.com/datasheet/GRM32ER61C476KE15L/78228.html; Supplier: LCSC; Tolerance: ±10%; Voltage Rating: 16V; Temperature Coefficient: X5R
C72 = C1608C0G1H470J/10: 容值:47pF;精度:±5%;额定电压:50V;温度系数:C0G；NP0;; LCSC Part Name: 47pF ±5% 50V; Supplier Part: C19485399; Manufacturer: TDK; Supplier Footprint: 0603; JLCPCB Part Class: Extended Part; Datasheet: https://item.szlcsc.com/datasheet/C1608C0G1H470J%252F10/20773786.html; Supplier: LCSC; Tolerance: ±5%; Voltage Rating: 50V; Temperature Coefficient: C0G；NP0
C74-C79 = 6SVPC330M: 容值:330uF;精度:±20%;额定电压:6.3V;纹波电流:3.39A@100kHz;等效串联电阻(ESR):17mΩ@100kHz;类型:聚合物;; LCSC Part Name: 330uF ±20% 6.3V; Supplier Part: C139569; Manufacturer: PANASONIC(松下); Supplier Footprint: SMD,D6.3xL5.9mm; JLCPCB Part Class: Extended Part; Datasheet: https://item.szlcsc.com/datasheet/6SVPC330M/150894.html; Supplier: LCSC; Tolerance: ±20%; Voltage Rating: 6.3V; Ripple Current: 3.39A@100kHz; Equivalent Series Resistance(ESR): 17mΩ@100kHz; Type: 聚合物; Diameter: 6.3mm; Height - Seated (Max): 5.9mm; Lifetime: 2000hrs@105℃; Operating Temperature: -55℃~+105℃
L1 = YSPI1365-1R0M: 电感值:1uH;精度:±20%;饱和电流(Isat):36A;; LCSC Part Name: 1uH ±20% 36A; Supplier Part: C5278950; Manufacturer: YJYCOIN(益嘉源); Supplier Footprint: SMD,13.8x12.6mm; JLCPCB Part Class: Extended Part; Datasheet: https://atta.szlcsc.com/upload/public/pdf/source/20221123/B5C8ED80AB877E8B7DB1203AF510D731.pdf; Supplier: LCSC; Tolerance: ±20%; Current - Saturation(Isat): 36A; DC Resistance(DCR): 2mΩ
L3 = SPM5030VT-1R0M-D: 电感值:1uH;精度:±20%;额定电流:9.4A;饱和电流(Isat):10.4A;类型:-;; LCSC Part Name: 1uH ±20% 10.4A; Supplier Part: C3223453; Manufacturer: TDK; Supplier Footprint: SMD,5.3x5.1mm; JLCPCB Part Class: Extended Part; Datasheet: https://atta.szlcsc.com/upload/public/pdf/source/20240402/25FDD5195B3E8AC94FB9DB93296B2CC0.pdf; Supplier: LCSC; Tolerance: ±20%; Rated Current: 9.4A; Saturation Current (Isat): 10.4A; DC Resistance (DCR): 9.6mΩ; Ratings: AEC-Q200
R1 = PTFR0603B6K65P9: 电阻类型:薄膜电阻;阻值:6.65kΩ;精度:±0.1%;功率:100mW;工作电压:100V;温度系数:±25ppm/℃;; LCSC Part Name: 薄膜电阻 6.65kΩ ±0.1% 100mW; Supplier Part: C47115983; Manufacturer: RESI(开步睿思); Supplier Footprint: 0603; JLCPCB Part Class: Extended Part; Datasheet: https://item.szlcsc.com/datasheet/PTFR0603B6K65P9/49306137.html; Supplier: LCSC; Type: 薄膜电阻; Tolerance: ±0.1%; Power(Watts): 100mW; Voltage-Supply(Max): 100V; Temperature Coefficient: ±25ppm/℃; Operating Temperature: -55℃~+155℃
R7 = FRC0603F8252TS: 电阻类型:厚膜电阻;阻值:82.5kΩ;精度:±1%;功率:100mW;工作电压:75V;温度系数:±100ppm/℃;; LCSC Part Name: 82.5kΩ ±1% 100mW 厚膜电阻; Supplier Part: C2999460; Manufacturer: FOJAN(富捷); Supplier Footprint: 0603; JLCPCB Part Class: Extended Part; Datasheet: https://item.szlcsc.com/datasheet/FRC0603F8252TS/3476900.html; Supplier: LCSC; Type: 厚膜电阻; Tolerance: ±1%; Power(Watts): 100mW; Voltage-Supply(Max): 75V; Temperature Coefficient: ±100ppm/℃; Operating Temperature: -55℃~+155℃
R8 = 0603WAF1692T5E: 电阻类型:厚膜电阻;阻值:16.9kΩ;精度:±1%;功率:100mW;工作电压:75V;温度系数:±100ppm/℃;; LCSC Part Name: 16.9kΩ ±1% 100mW 厚膜电阻; Supplier Part: C25954; Manufacturer: UNI-ROYAL(厚声); Supplier Footprint: 0603; JLCPCB Part Class: Extended Part; Datasheet: https://item.szlcsc.com/datasheet/0603WAF1692T5E/26697.html; Supplier: LCSC; Type: 厚膜电阻; Tolerance: ±1%; Power(Watts): 100mW; Voltage-Supply(Max): 75V; Temperature Coefficient: ±100ppm/℃; Operating Temperature: -55℃~+155℃
R9 = 0603WAF1622T5E: 电阻类型:厚膜电阻;阻值:16.2kΩ;精度:±1%;功率:100mW;工作电压:75V;温度系数:±100ppm/℃;; LCSC Part Name: 16.2kΩ ±1% 100mW 厚膜电阻; Supplier Part: C22885; Manufacturer: UNI-ROYAL(厚声); Supplier Footprint: 0603; JLCPCB Part Class: Extended Part; Datasheet: https://item.szlcsc.com/datasheet/0603WAF1622T5E/23612.html; Supplier: LCSC; Type: 厚膜电阻; Tolerance: ±1%; Power(Watts): 100mW; Voltage-Supply(Max): 75V; Temperature Coefficient: ±100ppm/℃; Operating Temperature: -55℃~+155℃
R3 R10-R12 R32 R35 = RT0603BRD0710KL: 电阻类型:薄膜电阻;阻值:10kΩ;精度:±0.1%;功率:100mW;工作电压:75V;温度系数:±25ppm/℃;; LCSC Part Name: 薄膜电阻 10kΩ ±0.1% 100mW; Supplier Part: C95204; Manufacturer: YAGEO(国巨); Supplier Footprint: 0603; JLCPCB Part Class: Extended Part; Datasheet: https://item.szlcsc.com/datasheet/RT0603BRD0710KL/96405.html; Supplier: LCSC; Type: 薄膜电阻; Tolerance: ±0.1%; Power(Watts): 100mW; Voltage-Supply(Max): 75V; Temperature Coefficient: ±25ppm/℃; Operating Temperature: -55℃~+155℃
R18 = RCA03200RFLF: 阻值:200Ω;精度:±1%;功率:100mW;; LCSC Part Name: 200Ω ±1% 100mW; Supplier Part: C22369809; Manufacturer: HKR(香港电阻); Supplier Footprint: 0603; JLCPCB Part Class: Extended Part; Datasheet: https://item.szlcsc.com/datasheet/RCA03200RFLF/23848840.html; Supplier: LCSC; Tolerance: ±1%; Power(Watts): 100mW
R38 = 0603WAF3012T5E: 电阻类型:厚膜电阻;阻值:30.1kΩ;精度:±1%;功率:100mW;工作电压:75V;温度系数:±100ppm/℃;; LCSC Part Name: 厚膜电阻 30.1kΩ ±1%; Supplier Part: C23000; Manufacturer: UNI-ROYAL(厚声); Supplier Footprint: 0603; JLCPCB Part Class: Extended Part; Datasheet: https://item.szlcsc.com/datasheet/0603WAF3012T5E/23727.html; Supplier: LCSC; Type: 厚膜电阻; Tolerance: ±1%; Power(Watts): 100mW; Voltage-Supply(Max): 75V; Temperature Coefficient: ±100ppm/℃; Operating Temperature: -55℃~+155℃
U49 = MP8795HGLE-Z: 功能类型:降压型;工作电压:4V~16V;输出电压:600mV~5.5V;输出电流:20A;输出类型:可调;; LCSC Part Name: 降压型 20A 4V~16V; Supplier Part: C3188703; Manufacturer: MPS(芯源); Supplier Footprint: QFN-21(3x4); JLCPCB Part Class: Extended Part; Datasheet: https://item.szlcsc.com/datasheet/MP8795HGLE-Z/3750645.html; Supplier: LCSC; Function: 降压型; Voltage - Supply: 4V~16V; Output Voltage: 600mV~5.5V; Output Current: 20A; Frequency - Switching: 1MHz；600kHz；800kHz; Operating Temperature: -40℃~+125℃@(TJ); Synchronous Rectifier: 是; Number of Outputs: 1; Topology: 降压式; Quiescent Current: 650uA; Switch tube (built-in/external): 内置; Output Type: 可调; Features: 输出电压差分采样；内置LDO稳压器；逐波限流；可调软启动；过流保护；输出电压跟随；工作状态指示；可调限流；打嗝限流；保护锁死
U50 = RT6253AHGJ6F: 功能类型:降压型;工作电压:4.5V~17V;输出电压:765mV~7V;输出电流:3A;输出类型:可调;; LCSC Part Name: 降压型 3A 4.5V~17V; Supplier Part: C2988423; Manufacturer: RICHTEK(立锜); Supplier Footprint: TSOT-23-6; JLCPCB Part Class: Extended Part; Datasheet: https://item.szlcsc.com/datasheet/RT6253AHGJ6F/3446411.html; Supplier: LCSC; Function: 降压型; Voltage - Supply: 4.5V~17V; Output Voltage: 765mV~7V; Output Current: 3A; Frequency - Switching: 580kHz; Operating Temperature: -40℃~+125℃; Synchronous Rectifier: 是; Number of Outputs: 1; Topology: 降压式; Quiescent Current: 280uA; Switch tube (built-in/external): 内置; Output Type: 可调; Features: 轻载高效模式；逐波限流；过流保护；打嗝限流
U51 = TPS630701RNMR: 功能类型:升降压型;工作电压:2V~16V;输出电压:5V;输出电流:2A;输出类型:固定;; LCSC Part Name: 升降压型 2A 2V~16V; Supplier Part: C2876599; Manufacturer: TI(德州仪器); Supplier Footprint: VQFN-15-HR(2.5x3); JLCPCB Part Class: Extended Part; Datasheet: https://www.ti.com/cn/lit/ds/symlink/tps63070.pdf; Supplier: LCSC; Function: 升降压型; Voltage - Supply: 2V~16V; Output Voltage: 5V; Output Current: 2A; Frequency - Switching: 2.4MHz; Operating Temperature: -40℃~+125℃@(TJ); Synchronous Rectifier: 是; Number of Outputs: 1; Topology: 降压-升压式; Quiescent Current: 50uA; Switch tube (built-in/external): 内置; Output Type: 固定; Features: 轻载高效模式；频率同步；过流保护；工作状态指示
U52 = LM66100DCKR_C2869734: LM66100 具有集成式 FET 的 1.5V 至 5.5V、1.5A、0.5μA IQ 理想二极管; LCSC Part Name: 5.5-V, 1.5-A 79-mΩ, 低静态电流理想二极管，带输入极性保护; Supplier Part: C2869734; Manufacturer: TI(德州仪器); Supplier Footprint: SC-70-6; JLCPCB Part Class: Extended Part; Datasheet: https://www.ti.com/cn/lit/ds/symlink/lm66100.pdf; Supplier: LCSC; Input Voltage (Vin): 1.5V~5.5V; Continuous Current (Imax): 1.5A; FET Type: 内置FET; Number of Channels: 1; RDS(on): 95mΩ; Quiescent Current: 150nA; Operating Temperature: -40℃~+125℃; Features: 带使能；反向极性保护；反向电流阻断
C88 = GRM188R71H103KA01D: 容值:10nF;精度:±10%;额定电压:50V;材质(温度系数):X7R;; LCSC Part Name: 10nF ±10% 50V; Supplier Part: C77053; Manufacturer: muRata(村田); Supplier Footprint: 0603; JLCPCB Part Class: Extended Part; Datasheet: https://atta.szlcsc.com/upload/public/pdf/source/20200305/C490387_23319AE8C154DEB24C505E6C82A8106A.pdf; Supplier: LCSC; Tolerance: ±10%; Voltage Rated: 50V; Temperature Coefficient: X7R
J_ESP_L J_ESP_R J_test = CS-1165SDIG-1*22: 插孔结构:1x22P;间距:2.54mm;行距:-;圆孔/方孔:方孔;安装方式:直插;排数:单排;总孔位数:22P;额定电流:3A;额定电压:250V;插孔方向:顶部;塑高:8.5mm;工作温度:-40℃~+105℃;; LCSC Part Name: 间距:2.54mm 1x22P 直插; Supplier Part: C2886702; Manufacturer: CST(永丰盈); Supplier Footprint: 插件,P=2.54mm; JLCPCB Part Class: Extended Part; Datasheet: https://item.szlcsc.com/datasheet/CS-1165SDIG-1*22/3101052.html; Supplier: LCSC; Holes Structure: 1x22P; Pitch: 2.54mm; Circular Hole / Square Hole: 方孔; Mounting Type: 直插; Number of Rows: 单排; Number of Positions: 22P; Current Rating: 3A; Voltage Rating (Max): 250V; Holes Direction: 顶部; Insulation Height: 8.5mm; Operating Temperature: -40℃~+105℃
R5 R13 R14 = RCA0320RFLF: 电阻类型:厚膜电阻;阻值:20Ω;精度:±1%;功率:100mW;工作电压:75V;温度系数:±100ppm/℃;; LCSC Part Name: 20Ω ±1% 100mW; Supplier Part: C22369786; Manufacturer: HKR(香港电阻); Supplier Footprint: 0603; JLCPCB Part Class: Extended Part; Datasheet: https://item.szlcsc.com/datasheet/RCA0320RFLF/23848817.html; Supplier: LCSC; Type: 厚膜电阻; Tolerance: ±1%; Power(Watts): 100mW; Voltage-Supply(Max): 75V; Temperature Coefficient: ±100ppm/℃; Operating Temperature: -55℃~+155℃
R6 = RT0603BRD0720KL: 电阻类型:薄膜电阻;阻值:20kΩ;精度:±0.1%;功率:100mW;工作电压:75V;温度系数:±25ppm/℃;; LCSC Part Name: 薄膜电阻 20kΩ ±0.1% 100mW; Supplier Part: C723637; Manufacturer: YAGEO(国巨); Supplier Footprint: 0603; JLCPCB Part Class: Extended Part; Datasheet: https://item.szlcsc.com/datasheet/RT0603BRD0720KL/768328.html; Supplier: LCSC; Type: 薄膜电阻; Tolerance: ±0.1%; Power(Watts): 100mW; Voltage-Supply(Max): 75V; Temperature Coefficient: ±25ppm/℃; Operating Temperature: -55℃~+155℃
R15 = RCT0339KFLF: 电阻类型:厚膜电阻;阻值:39kΩ;精度:±1%;功率:100mW;工作电压:75V;温度系数:±100ppm/℃;; LCSC Part Name: 39kΩ ±1% 100mW; Supplier Part: C177669; Manufacturer: HKR(香港电阻); Supplier Footprint: 0603; JLCPCB Part Class: Extended Part; Datasheet: https://item.szlcsc.com/datasheet/RCT0339KFLF/189061.html; Supplier: LCSC; Type: 厚膜电阻; Tolerance: ±1%; Power(Watts): 100mW; Voltage-Supply(Max): 75V; Temperature Coefficient: ±100ppm/℃; Operating Temperature: -55℃~+155℃
R19 = FRC0805P000 TS: 电阻类型:厚膜电阻;阻值:0Ω;精度:±5%;功率:125mW;工作电压:150V;; LCSC Part Name: 0Ω ±5% 125mW 厚膜电阻; Supplier Part: C2907288; Manufacturer: FOJAN(富捷); Supplier Footprint: 0805; JLCPCB Part Class: Extended Part; Supplier: LCSC; Type: 厚膜电阻; Tolerance: ±5%; Power(Watts): 125mW; Voltage-Supply(Max): 150V; Operating Temperature: -55℃~+155℃
R34 = FRC0603F1503TS: 电阻类型:厚膜电阻;阻值:150kΩ;精度:±1%;功率:100mW;工作电压:75V;温度系数:±100ppm/℃;; LCSC Part Name: 150kΩ ±1% 100mW 厚膜电阻; Supplier Part: C2906993; Manufacturer: FOJAN(富捷); Supplier Footprint: 0603; JLCPCB Part Class: Extended Part; Supplier: LCSC; Type: 厚膜电阻; Tolerance: ±1%; Power(Watts): 100mW; Voltage-Supply(Max): 75V; Temperature Coefficient: ±100ppm/℃; Operating Temperature: -55℃~+155℃
R36 = TD03G3903BT: 电阻类型:薄膜电阻;阻值:390kΩ;精度:±0.1%;功率:100mW;工作电压:50V;温度系数:±25ppm/℃;; LCSC Part Name: 薄膜电阻 390kΩ ±0.1% 100mW; Supplier Part: C667213; Manufacturer: FH(风华); Supplier Footprint: 0603; JLCPCB Part Class: Extended Part; Datasheet: https://item.szlcsc.com/datasheet/TD03G3903BT/696513.html; Supplier: LCSC; Type: 薄膜电阻; Tolerance: ±0.1%; Power(Watts): 100mW; Voltage-Supply(Max): 50V; Temperature Coefficient: ±25ppm/℃; Operating Temperature: -55℃~+155℃
R40-R42 = 0603WAF4702T5E: 电阻类型:厚膜电阻;阻值:47kΩ;精度:±1%;功率:100mW;工作电压:75V;温度系数:±100ppm/℃;; LCSC Part Name: 厚膜电阻 47kΩ ±1%; Supplier Part: C25819; Manufacturer: UNI-ROYAL(厚声); Supplier Footprint: 0603; JLCPCB Part Class: Basic Part; Datasheet: https://item.szlcsc.com/datasheet/0603WAF4702T5E/26562.html; Supplier: LCSC; Type: 厚膜电阻; Tolerance: ±1%; Power(Watts): 100mW; Voltage-Supply(Max): 75V; Temperature Coefficient: ±100ppm/℃; Operating Temperature: -55℃~+155℃; PCB Layer: Default
SW1 = TSA06131-250B532CA: 6*6*25插件轻触开关、280g、Fe盖、PC黑柄; LCSC Part Name: 6*6*25直插轻触开关280gf; Supplier Part: C49174365; Manufacturer: Khon(康宏电子); Supplier Footprint: 插件-4P,6.1x6.1mm; JLCPCB Part Class: Extended Part; Datasheet: https://item.szlcsc.com/datasheet/TSA06131-250B532CA/51568389.html; Supplier: LCSC
SW2 = SK-12D07-VG 4 NS PA: 电路结构:单刀双掷;安装方式:直插;额定电压(DC):30V;; Supplier Part: C2818299; Manufacturer: C&K; Supplier Footprint: 插件; JLCPCB Part Class: Extended Part; Datasheet: https://atta.szlcsc.com/upload/public/pdf/source/20230525/6DFD905F5DA9CFE0095C6B3B85F8C460.pdf; Supplier: LCSC; Circuit: 单刀双掷; Actuator Style: 矩形柱状; Pin Style: PC引脚; Mounting Style: 直插; Voltage Rating (DC): 30V; Operating Temperature: -20℃~+70℃
U54 = TMUX1511PWR: 开关电路:1:1;通道数:4;导通电阻(Ron):4.5Ω;; LCSC Part Name: 低电容4通道1:1 SPST断电保护开关; Supplier Part: C2866750; Manufacturer: TI(德州仪器); Supplier Footprint: TSSOP-14; JLCPCB Part Class: Extended Part; Datasheet: https://www.ti.com/cn/lit/ds/symlink/tmux1511.pdf; Supplier: LCSC; Switch Circuit: 1:1; Number of Channels: 4; Ron: 4.5Ω; Voltage - Supply: 1.5V~5.5V; Con: 3.3pF; Turn-on time: 60us; Turn-off time: 4us; Bandwidth: 3GHz; Operating Temperature: -40℃~+125℃; Features: 双向模拟通道；断电隔离；失效安全断开; Charge Injection: 2pC
U55 = TPS3700DDCR: 比较器数:双路;输入失调电压(Vos):-;输入偏置电流(Ib):1nA;; LCSC Part Name: 用于过压和欠压检测的窗口比较器; Supplier Part: C33002; Manufacturer: TI(德州仪器); Supplier Footprint: SOT-23-6; JLCPCB Part Class: Extended Part; Datasheet: https://www.ti.com/cn/lit/ds/symlink/tps3700.pdf; Supplier: LCSC; Number of Channels: 双路; Ib - Input Bias Current: 1nA; Propagation Delay Time: 29us; Input Hysteresis Voltage (Vhys): 5.5mV; Output Type: 开漏; Quiescent Current: 11uA; Operating Temperature: -40℃~+125℃; Single Supply: 1.8V~18V; Response Time (tr): 2.2us
U1-U15 U46 = SN74HC595DR: 功能:串行至串行或并行;工作电压:2V~6V;时钟频率(fc):29MHz;元件数:1;每个元件位数:8;; LCSC Part Name: 三态输出 8位串行至串行或并行移位寄存器; Supplier Part: C10092; Manufacturer: TI(德州仪器); Supplier Footprint: SOIC-16; JLCPCB Part Class: Extended Part; Datasheet: https://www.ti.com/cn/lit/gpn/sn74hc595; Supplier: LCSC; Function: 串行至串行或并行; Voltage - Supply: 2V~6V; Clock Frequency: 29MHz; Number of Elements: 1; Number of Bits per Element: 8; Output Type: 三态; Series: 74HC; Operating Temperature: -40℃~+85℃; Propagation Delay: 26ns@6V,50pF; Output Current: 6mA
U16-U30 U47 = ULN2003A_C181730: 通道数:七路;集射极击穿电压(Vceo):50V;集电极电流(Ic):500mA;; LCSC Part Name: 七路高耐压、大电流达林顿晶体管阵列; Supplier Part: C181730; Manufacturer: Mixic(中科芯亿达); Supplier Footprint: SOP-16-150mil; JLCPCB Part Class: Extended Part; Datasheet: https://item.szlcsc.com/datasheet/ULN2003A/193127.html; Supplier: LCSC; number of channels: 七路; Collector - Emitter Voltage VCEO: 50V; Current - Collector(Ic): 500mA; Voltage - Input(Max): 30V; Output Leakage Current(Icex): 50uA; Vce Saturation(VCE(sat)): 1.6V; Input Current(on): 1.35mA; Input Current(off): 65uA; Voltage - Forward(Vf): 1.7V; Reverse Leakage Current (Ir): 50uA; Input Capacitiance(Ci): 15pF; Type: BJT
U31-U45 U48 = HC-PM127-4.3H-1x12PZ: 插孔结构:1x12P;间距:1.27mm;行距:-;圆孔/方孔:方孔;安装方式:直插;排数:单排;总孔位数:12P;额定电流:1A;额定电压:-;插孔方向:顶部;塑高:4.3mm;触头材质:磷青铜;触头镀层:金;工作温度:-40℃~+105℃;; LCSC Part Name: 间距1.27mm 1x12Pin 直插 PC2.4 H4.3; Supplier Part: C22436112; Manufacturer: HC(虹成电子); Supplier Footprint: 插件,P=1.27mm; JLCPCB Part Class: Extended Part; Datasheet: https://item.szlcsc.com/datasheet/HC-PM127-4.3H-1x12PZ/24066788.html; Supplier: LCSC; Holes Structure: 1x12P; Pitch: 1.27mm; Circular Hole / Square Hole: 方孔; Mounting Type: 直插; Number of Rows: 单排; Number of Positions: 12P; Current Rating: 1A; Holes Direction: 顶部; Insulation Height: 4.3mm; Contact Material: 磷青铜; Contact Plating: 金; Operating Temperature: -40℃~+105℃; PIN Length: 2.4mm

## Nets
GND: C1.2 C2.2 C3.2 C4.2 C5.2 C6.2 C7.2 C8.2 C9.2 C10.2 C11.2 C12.2 C13.2 C14.2 C15.2 C31.2 C32.1 C34.1 C36.2 C40.2 C41.2 C43.2 C44.1 C45.1 C46.1 C47.1 C48.1 C49.1 C50.1 C51.1 C52.1 C53.1 C54.1 C55.1 C56.1 C57.1 C58.1 C59.1 C60.1 C61.2 C62.1 C63.1 C65.2 C66.2 C67.2 C68.2 C69.1 C70.2 C71.2 C74.2 C75.2 C76.2 C77.2 C78.2 C79.2 C80.2 C82.1 C83.2 C84.2 C86.2 C87.2 C88.2 C89.2 C90.2 C91.2 D1.1(C) D2.1(C) deR28.1 J1.7(EH) J1.A12(GND) J1.B12(GND) J4.1 J_ESP_L.22 J_ESP_R.1 J_NTC.2 J_test.2 J_test.4 J_test.9 J_test.12 J_test.22 R1.1 R2.1 R3.2 R8.1 R10.2 R15.1 R16.1 R17.1 R18.2 R20.1 R21.1 R22.1 R31.1 R33.1 R35.2 R37.2 R38.1 R39.1 R40.2 R41.2 R42.2 SW1.1 SW2.1 SW2.EH U1.8(GND) U2.8(GND) U3.8(GND) U4.8(GND) U5.8(GND) U6.8(GND) U7.8(GND) U8.8(GND) U9.8(GND) U10.8(GND) U11.8(GND) U12.8(GND) U13.8(GND) U14.8(GND) U15.8(GND) U16.8(E) U17.8(E) U18.8(E) U19.8(E) U20.8(E) U21.8(E) U22.8(E) U23.8(E) U24.8(E) U25.8(E) U26.8(E) U27.8(E) U28.8(E) U29.8(E) U30.8(E) U46.8(GND) U47.8(E) U49.2(AGND) U49.6(VSNS-) U49.11(PGND) U49.12(PGND) U49.13(PGND) U49.14(PGND) U49.15(PGND) U49.16(PGND) U49.17(PGND) U49.18(PGND) U50.1(GND) U51.1(PS/SYNC) U51.4(GND) U51.10(PGND) U51.15(VSEL) U52.2(GND) U52.4(NC) U52.5(ST) U53.18(PGND) U53.25(EP) U54.7(GND) U54.8(D3) U55.2(GND) U55.4(INB-)
V5S: C89.1 J_ESP_L.21 J_test.10 U52.3(CE#) U52.6(VOUT)
VBAT: C36.1 C59.2 C60.2 C61.1 C62.2 C63.2 C80.1 C91.1 J_test.7 Q1.1(S) Q1.2(S) Q1.3(S) R30.2 SW2.3 U49.10(VIN) U49.21(VIN) U50.3(VIN) U51.12(VIN) U51.13(VIN)
VBAT_DIV: C40.1 R15.2 R30.1 U54.2(S1)
VCC: C32.2 C44.2 C45.2 C46.2 C47.2 C48.2 C49.2 C50.2 C51.2 C52.2 C53.2 C54.2 C55.2 C56.2 C57.2 C58.2 C72.1 C74.1 C75.1 C76.1 C77.1 C78.1 C79.1 J_test.1 L1.2 R7.1 U16.9(COM) U17.9(COM) U18.9(COM) U19.9(COM) U20.9(COM) U21.9(COM) U22.9(COM) U23.9(COM) U24.9(COM) U25.9(COM) U26.9(COM) U27.9(COM) U28.9(COM) U29.9(COM) U30.9(COM) U31.1 U31.5 U31.7 U31.10 U32.1 U32.5 U32.7 U32.10 U33.1 U33.5 U33.7 U33.10 U34.1 U34.5 U34.7 U34.10 U35.1 U35.5 U35.7 U35.10 U36.1 U36.5 U36.7 U36.10 U37.1 U37.5 U37.7 U37.10 U38.1 U38.5 U38.7 U38.10 U39.1 U39.5 U39.7 U39.10 U40.1 U40.5 U40.7 U40.10 U41.1 U41.5 U41.7 U41.10 U42.1 U42.5 U42.7 U42.10 U43.1 U43.5 U43.7 U43.10 U44.1 U44.5 U44.7 U44.10 U45.1 U45.5 U45.7 U45.10 U47.9(COM) U48.1 U48.5 U48.7 U48.10
VCC_LOGIC: C1.1 C2.1 C3.1 C4.1 C5.1 C6.1 C7.1 C8.1 C9.1 C10.1 C11.1 C12.1 C13.1 C14.1 C15.1 C31.1 C86.1 J_test.5 R11.2 R12.2 R19.1 R25.2 U1.16(VCC) U2.16(VCC) U3.16(VCC) U4.16(VCC) U5.16(VCC) U6.16(VCC) U7.16(VCC) U8.16(VCC) U9.16(VCC) U10.16(VCC) U11.16(VCC) U12.16(VCC) U13.16(VCC) U14.16(VCC) U15.16(VCC) U46.16(VCC)
VCCS: C41.1 J_test.3 L2.1 R9.1 R18.1 U31.12 U32.12 U33.12 U34.12 U35.12 U36.12 U37.12 U38.12 U39.12 U40.12 U41.12 U42.12 U43.12 U44.12 U45.12 U48.12
VIN_C: C65.1 C66.1 J1.A9(VBUS) J1.B9(VBUS) J_test.8 L4.2 R23.2
ADC_EN: J_ESP_L.5 R33.2 U54.1(SEL1)
BAT+: C67.1 C68.1 J3.1 Q1.5(D) Q1.6(D) Q1.7(D) Q1.8(D) Q1.9(D) U53.21(VOUT) U53.22(VOUT)
CHG_BST: C39.1 U53.14(BST)
CHG_EN: R4.1 U53.12(EN)
CHG_ISET: R20.2 U53.11(ISET)
CHG_LED: R24.1 U53.6(LED)
CHG_LED_A: D1.2(A) R24.2
CHG_NTC: J_NTC.1 R22.2 U53.4(NTC)
CHG_SW: C39.2 L4.1 U53.15(LX) U53.16(LX) U53.17(LX)
CHG_TIMER: R21.2 U53.7(TIME_SET)
CHG_UVSET: deR28.2 U53.8(VIN_UVSET)
CHG_VIN_FILTER: C83.1 R4.2 R23.1 U53.13(VIN)
CHG_VSET: R39.2 U53.3(VSET)
CHG_VSYS: C69.2 C70.1 U53.19(VSYS) U53.20(VSYS)
DRV01_A: U1.15(QA) U16.1(1B)
DRV01_B: U1.1(QB) U16.2(2B)
DRV01_C: U1.2(QC) U16.3(3B)
DRV01_D: U1.3(QD) U16.4(4B)
DRV01_E: U1.4(QE) U16.5(5B)
DRV01_F: U1.5(QF) U16.6(6B)
DRV01_SMA: U1.6(QG) U16.7(7B)
DRV02_A: U2.15(QA) U17.1(1B)
DRV02_B: U2.1(QB) U17.2(2B)
DRV02_C: U2.2(QC) U17.3(3B)
DRV02_D: U2.3(QD) U17.4(4B)
DRV02_E: U2.4(QE) U17.5(5B)
DRV02_F: U2.5(QF) U17.6(6B)
DRV02_SMA: U2.6(QG) U17.7(7B)
DRV03_A: U3.15(QA) U18.1(1B)
DRV03_B: U3.1(QB) U18.2(2B)
DRV03_C: U3.2(QC) U18.3(3B)
DRV03_D: U3.3(QD) U18.4(4B)
DRV03_E: U3.4(QE) U18.5(5B)
DRV03_F: U3.5(QF) U18.6(6B)
DRV03_SMA: U3.6(QG) U18.7(7B)
DRV04_A: U4.15(QA) U19.1(1B)
DRV04_B: U4.1(QB) U19.2(2B)
DRV04_C: U4.2(QC) U19.3(3B)
DRV04_D: U4.3(QD) U19.4(4B)
DRV04_E: U4.4(QE) U19.5(5B)
DRV04_F: U4.5(QF) U19.6(6B)
DRV04_SMA: U4.6(QG) U19.7(7B)
DRV05_A: U5.15(QA) U20.1(1B)
DRV05_B: U5.1(QB) U20.2(2B)
DRV05_C: U5.2(QC) U20.3(3B)
DRV05_D: U5.3(QD) U20.4(4B)
DRV05_E: U5.4(QE) U20.5(5B)
DRV05_F: U5.5(QF) U20.6(6B)
DRV05_SMA: U5.6(QG) U20.7(7B)
DRV06_A: U6.15(QA) U21.1(1B)
DRV06_B: U6.1(QB) U21.2(2B)
DRV06_C: U6.2(QC) U21.3(3B)
DRV06_D: U6.3(QD) U21.4(4B)
DRV06_E: U6.4(QE) U21.5(5B)
DRV06_F: U6.5(QF) U21.6(6B)
DRV06_SMA: U6.6(QG) U21.7(7B)
DRV07_A: U7.15(QA) U22.1(1B)
DRV07_B: U7.1(QB) U22.2(2B)
DRV07_C: U7.2(QC) U22.3(3B)
DRV07_D: U7.3(QD) U22.4(4B)
DRV07_E: U7.4(QE) U22.5(5B)
DRV07_F: U7.5(QF) U22.6(6B)
DRV07_SMA: U7.6(QG) U22.7(7B)
DRV08_A: U8.15(QA) U23.1(1B)
DRV08_B: U8.1(QB) U23.2(2B)
DRV08_C: U8.2(QC) U23.3(3B)
DRV08_D: U8.3(QD) U23.4(4B)
DRV08_E: U8.4(QE) U23.5(5B)
DRV08_F: U8.5(QF) U23.6(6B)
DRV08_SMA: U8.6(QG) U23.7(7B)
DRV09_A: U9.15(QA) U24.1(1B)
DRV09_B: U9.1(QB) U24.2(2B)
DRV09_C: U9.2(QC) U24.3(3B)
DRV09_D: U9.3(QD) U24.4(4B)
DRV09_E: U9.4(QE) U24.5(5B)
DRV09_F: U9.5(QF) U24.6(6B)
DRV09_SMA: U9.6(QG) U24.7(7B)
DRV10_A: U10.15(QA) U25.1(1B)
DRV10_B: U10.1(QB) U25.2(2B)
DRV10_C: U10.2(QC) U25.3(3B)
DRV10_D: U10.3(QD) U25.4(4B)
DRV10_E: U10.4(QE) U25.5(5B)
DRV10_F: U10.5(QF) U25.6(6B)
DRV10_SMA: U10.6(QG) U25.7(7B)
DRV11_A: U11.15(QA) U26.1(1B)
DRV11_B: U11.1(QB) U26.2(2B)
DRV11_C: U11.2(QC) U26.3(3B)
DRV11_D: U11.3(QD) U26.4(4B)
DRV11_E: U11.4(QE) U26.5(5B)
DRV11_F: U11.5(QF) U26.6(6B)
DRV11_SMA: U11.6(QG) U26.7(7B)
DRV12_A: U12.15(QA) U27.1(1B)
DRV12_B: U12.1(QB) U27.2(2B)
DRV12_C: U12.2(QC) U27.3(3B)
DRV12_D: U12.3(QD) U27.4(4B)
DRV12_E: U12.4(QE) U27.5(5B)
DRV12_F: U12.5(QF) U27.6(6B)
DRV12_SMA: U12.6(QG) U27.7(7B)
DRV13_A: U13.15(QA) U28.1(1B)
DRV13_B: U13.1(QB) U28.2(2B)
DRV13_C: U13.2(QC) U28.3(3B)
DRV13_D: U13.3(QD) U28.4(4B)
DRV13_E: U13.4(QE) U28.5(5B)
DRV13_F: U13.5(QF) U28.6(6B)
DRV13_SMA: U13.6(QG) U28.7(7B)
DRV14_A: U14.15(QA) U29.1(1B)
DRV14_B: U14.1(QB) U29.2(2B)
DRV14_C: U14.2(QC) U29.3(3B)
DRV14_D: U14.3(QD) U29.4(4B)
DRV14_E: U14.4(QE) U29.5(5B)
DRV14_F: U14.5(QF) U29.6(6B)
DRV14_SMA: U14.6(QG) U29.7(7B)
DRV15_A: U15.15(QA) U30.1(1B)
DRV15_B: U15.1(QB) U30.2(2B)
DRV15_C: U15.2(QC) U30.3(3B)
DRV15_D: U15.3(QD) U30.4(4B)
DRV15_E: U15.4(QE) U30.5(5B)
DRV15_F: U15.5(QF) U30.6(6B)
DRV15_SMA: U15.6(QG) U30.7(7B)
DRV16_A: U46.15(QA) U47.1(1B)
DRV16_B: U46.1(QB) U47.2(2B)
DRV16_C: U46.2(QC) U47.3(3B)
DRV16_D: U46.3(QD) U47.4(4B)
DRV16_E: U46.4(QE) U47.5(5B)
DRV16_F: U46.5(QF) U47.6(6B)
DRV16_SMA: U46.6(QG) U47.7(7B)
EN_MAIN: J_test.17 R3.1 R6.2 R36.1 U49.8(EN) U51.14(EN) U54.10(SEL3) U54.13(SEL4) U55.1(OUTA)
EN_SMA: R37.1 U50.5(EN) U54.12(S4)
ESP_3V3: C90.1 J_ESP_L.1 J_ESP_L.2 J_test.6 R19.2 R32.2 U54.14(VDD)
ESP_5V_RAW: C43.1 C84.1 U51.5(FB) U51.7(VOUT) U51.8(VOUT) U52.1(VIN)
ESP_SW1: L3.1 U51.11(L1)
ESP_SW2: L3.2 U51.9(L2)
ESP_VAUX: C82.2 U51.3(VAUX)
GPIO4: J_ESP_L.4 J_test.15 U54.3(D1)
GPIO6: J_ESP_L.6 SW1.3
GPIO9_ENABLE: J_ESP_L.15 J_test.19 R31.2 U54.4(SEL2)
GPIO10_RCLK: J_ESP_L.16 R14.1
GPIO11_SER: J_ESP_L.17 R5.1
GPIO12_SRCLK: J_ESP_L.18 R13.1
GPIO13: J_ESP_L.19 J_test.14 U46.9(QH#)
M1.PIN2: U16.16(1C) U31.2
M1.PIN3: U16.10(7C) U31.3
M1.PIN4: U16.15(2C) U31.4
M1.PIN6: U16.14(3C) U31.6
M1.PIN8: U16.13(4C) U31.8
M1.PIN9: U16.12(5C) U31.9
M1.PIN11: U16.11(6C) U31.11
M2.PIN2: U17.16(1C) U32.2
M2.PIN3: U17.10(7C) U32.3
M2.PIN4: U17.15(2C) U32.4
M2.PIN6: U17.14(3C) U32.6
M2.PIN8: U17.13(4C) U32.8
M2.PIN9: U17.12(5C) U32.9
M2.PIN11: U17.11(6C) U32.11
M3.PIN2: U18.16(1C) U33.2
M3.PIN3: U18.10(7C) U33.3
M3.PIN4: U18.15(2C) U33.4
M3.PIN6: U18.14(3C) U33.6
M3.PIN8: U18.13(4C) U33.8
M3.PIN9: U18.12(5C) U33.9
M3.PIN11: U18.11(6C) U33.11
M4.PIN2: U19.16(1C) U34.2
M4.PIN3: U19.10(7C) U34.3
M4.PIN4: U19.15(2C) U34.4
M4.PIN6: U19.14(3C) U34.6
M4.PIN8: U19.13(4C) U34.8
M4.PIN9: U19.12(5C) U34.9
M4.PIN11: U19.11(6C) U34.11
M5.PIN2: U20.16(1C) U35.2
M5.PIN3: U20.10(7C) U35.3
M5.PIN4: U20.15(2C) U35.4
M5.PIN6: U20.14(3C) U35.6
M5.PIN8: U20.13(4C) U35.8
M5.PIN9: U20.12(5C) U35.9
M5.PIN11: U20.11(6C) U35.11
M6.PIN2: U21.16(1C) U36.2
M6.PIN3: U21.10(7C) U36.3
M6.PIN4: U21.15(2C) U36.4
M6.PIN6: U21.14(3C) U36.6
M6.PIN8: U21.13(4C) U36.8
M6.PIN9: U21.12(5C) U36.9
M6.PIN11: U21.11(6C) U36.11
M7.PIN2: U22.16(1C) U37.2
M7.PIN3: U22.10(7C) U37.3
M7.PIN4: U22.15(2C) U37.4
M7.PIN6: U22.14(3C) U37.6
M7.PIN8: U22.13(4C) U37.8
M7.PIN9: U22.12(5C) U37.9
M7.PIN11: U22.11(6C) U37.11
M8.PIN2: U23.16(1C) U38.2
M8.PIN3: U23.10(7C) U38.3
M8.PIN4: U23.15(2C) U38.4
M8.PIN6: U23.14(3C) U38.6
M8.PIN8: U23.13(4C) U38.8
M8.PIN9: U23.12(5C) U38.9
M8.PIN11: U23.11(6C) U38.11
M9.PIN2: U24.16(1C) U39.2
M9.PIN3: U24.10(7C) U39.3
M9.PIN4: U24.15(2C) U39.4
M9.PIN6: U24.14(3C) U39.6
M9.PIN8: U24.13(4C) U39.8
M9.PIN9: U24.12(5C) U39.9
M9.PIN11: U24.11(6C) U39.11
M10.PIN2: U25.16(1C) U40.2
M10.PIN3: U25.10(7C) U40.3
M10.PIN4: U25.15(2C) U40.4
M10.PIN6: U25.14(3C) U40.6
M10.PIN8: U25.13(4C) U40.8
M10.PIN9: U25.12(5C) U40.9
M10.PIN11: U25.11(6C) U40.11
M11.PIN2: U26.16(1C) U41.2
M11.PIN3: U26.10(7C) U41.3
M11.PIN4: U26.15(2C) U41.4
M11.PIN6: U26.14(3C) U41.6
M11.PIN8: U26.13(4C) U41.8
M11.PIN9: U26.12(5C) U41.9
M11.PIN11: U26.11(6C) U41.11
M12.PIN2: U27.16(1C) U42.2
M12.PIN3: U27.10(7C) U42.3
M12.PIN4: U27.15(2C) U42.4
M12.PIN6: U27.14(3C) U42.6
M12.PIN8: U27.13(4C) U42.8
M12.PIN9: U27.12(5C) U42.9
M12.PIN11: U27.11(6C) U42.11
M13.PIN2: U28.16(1C) U43.2
M13.PIN3: U28.10(7C) U43.3
M13.PIN4: U28.15(2C) U43.4
M13.PIN6: U28.14(3C) U43.6
M13.PIN8: U28.13(4C) U43.8
M13.PIN9: U28.12(5C) U43.9
M13.PIN11: U28.11(6C) U43.11
M14.PIN2: U29.16(1C) U44.2
M14.PIN3: U29.10(7C) U44.3
M14.PIN4: U29.15(2C) U44.4
M14.PIN6: U29.14(3C) U44.6
M14.PIN8: U29.13(4C) U44.8
M14.PIN9: U29.12(5C) U44.9
M14.PIN11: U29.11(6C) U44.11
M15.PIN2: U30.16(1C) U45.2
M15.PIN3: U30.10(7C) U45.3
M15.PIN4: U30.15(2C) U45.4
M15.PIN6: U30.14(3C) U45.6
M15.PIN8: U30.13(4C) U45.8
M15.PIN9: U30.12(5C) U45.9
M15.PIN11: U30.11(6C) U45.11
M16.PIN2: U47.16(1C) U48.2
M16.PIN3: U47.10(7C) U48.3
M16.PIN4: U47.15(2C) U48.4
M16.PIN6: U47.14(3C) U48.6
M16.PIN8: U47.13(4C) U48.8
M16.PIN9: U47.12(5C) U48.9
M16.PIN11: U47.11(6C) U48.11
MAIN_BST: C33.2 U49.1(BST)
MAIN_FB: C72.2 R7.2 R8.2 U49.7(FB)
MAIN_ILIM: R1.2 U49.3(CS)
MAIN_MODE: R38.2 U49.4(MODE)
MAIN_SS: C34.2 U49.5(REF/TRK)
MAIN_SW: C33.1 L1.1 U49.20(SW)
MAIN_VCC_INT: C71.1 U49.19(VCC)
OE#: J_test.18 R11.1 U1.13(OE#) U2.13(OE#) U3.13(OE#) U4.13(OE#) U5.13(OE#) U6.13(OE#) U7.13(OE#) U8.13(OE#) U9.13(OE#) U10.13(OE#) U11.13(OE#) U12.13(OE#) U13.13(OE#) U14.13(OE#) U15.13(OE#) U46.13(OE#) U54.5(S2)
OE_GATE_MID: U54.6(D2) U54.9(S3)
PGOOD: J_ESP_L.20 J_test.21 R32.1 U49.9(PGOOD) U54.11(D4)
RCLK: J_test.16 R14.2 R42.1 U1.12(RCLK) U2.12(RCLK) U3.12(RCLK) U4.12(RCLK) U5.12(RCLK) U6.12(RCLK) U7.12(RCLK) U8.12(RCLK) U9.12(RCLK) U10.12(RCLK) U11.12(RCLK) U12.12(RCLK) U13.12(RCLK) U14.12(RCLK) U15.12(RCLK) U46.12(RCLK)
REVERSE_GATE: Q1.4(G) R2.2
RUN_LED_A: D2.2(A) R25.1
SER_02: U1.9(QH#) U2.14(SER)
SER_03: U2.9(QH#) U3.14(SER)
SER_04: U3.9(QH#) U4.14(SER)
SER_05: U4.9(QH#) U5.14(SER)
SER_06: U5.9(QH#) U6.14(SER)
SER_07: U6.9(QH#) U7.14(SER)
SER_08: U7.9(QH#) U8.14(SER)
SER_09: U8.9(QH#) U9.14(SER)
SER_10: U9.9(QH#) U10.14(SER)
SER_11: U10.9(QH#) U11.14(SER)
SER_12: U11.9(QH#) U12.14(SER)
SER_13: U12.9(QH#) U13.14(SER)
SER_14: U13.9(QH#) U14.14(SER)
SER_15: U14.9(QH#) U15.14(SER)
SER_16: U15.9(QH#) U46.14(SER)
SMA_BST: C35.1 U50.6(BOOT)
SMA_FB: R9.2 R10.1 U50.4(FB)
SMA_SW: C35.2 L2.2 U50.2(SW)
SRCLK: J_test.11 R13.2 R41.1 U1.11(SRCLK) U2.11(SRCLK) U3.11(SRCLK) U4.11(SRCLK) U5.11(SRCLK) U6.11(SRCLK) U7.11(SRCLK) U8.11(SRCLK) U9.11(SRCLK) U10.11(SRCLK) U11.11(SRCLK) U12.11(SRCLK) U13.11(SRCLK) U14.11(SRCLK) U15.11(SRCLK) U46.11(SRCLK)
SRCLR#: J_ESP_L.12 J_test.20 R12.1 U1.10(SRCLR#) U2.10(SRCLR#) U3.10(SRCLR#) U4.10(SRCLR#) U5.10(SRCLR#) U6.10(SRCLR#) U7.10(SRCLR#) U8.10(SRCLR#) U9.10(SRCLR#) U10.10(SRCLR#) U11.10(SRCLR#) U12.10(SRCLR#) U13.10(SRCLR#) U14.10(SRCLR#) U15.10(SRCLR#) U46.10(SRCLR#)
SWITCHED_VBAT: C87.1 R6.1 R34.1 SW2.2 U55.5(VDD)
U1.SER: J_test.13 R5.2 R40.1 U1.14(SER)
USB_CC1: J1.A5(CC1) R16.2
USB_CC2: J1.B5(CC2) R17.2
UV_SENSE: C88.1 R34.2 R35.1 R36.2 U55.3(INA+)

Not connected (* = marked no-connect by the designer): J_ESP_L 3* 7* 8* 9* 10* 11* 13* 14*; J_ESP_R 2* 3* 4* 5* 6* 7* 8* 9* 10* 11* 12* 13* 14* 15* 16* 17* 18* 19* 20* 21* 22*; SW1 2* 4*; U1 7(QH)*; U2 7(QH)*; U3 7(QH)*; U4 7(QH)*; U5 7(QH)*; U6 7(QH)*; U7 7(QH)*; U8 7(QH)*; U9 7(QH)*; U10 7(QH)*; U11 7(QH)*; U12 7(QH)*; U13 7(QH)*; U14 7(QH)*; U15 7(QH)*; U46 7(QH)*; U51 2(PG)* 6(FB2)*; U53 1(DM)* 2(DP)* 5(BAT_STAT)* 9(VIN_OVSET)* 10(CON_SEL)* 23(VBATM)* 24(VBAT_GND)*; U55 6(OUTB)*

## Notes on the sheets
sheet 1
- LINGTOUCH  |  02  Power  Rails
- REV 2026-10-08  /  CLOUD test CURRENT BASELINE  /  TWO PCB PLACEMENT VARIANTS
- MAIN COIL RAIL / MP8795H / VCC = 3.529 V
- SMA RAIL / RT6253A / 2.004 V
- 1uH
- RT6253AHGJ6F
- 47uF
- 47uF
- 100nF
- MP8795HGLE-Z
- 2.2uH
- 100nF
- 1uF
- 6.65kΩ
- 30.1kΩ
- 1uF
- 82.5kΩ
- 100nF
- 47uF
- 16.9kΩ
- 47pF
- 100nF
- 16.2kΩ
- 10kΩ
- 100kΩ
- 330uF
- 330uF
- 330uF
- 330uF
- 330uF
- 330uF
- 47uF
- 200Ω
- ESP 5 V CONVERTER / TPS630701
- REVERSE BLOCKING / LM66100
- 1uH
- 47uF
- 100nF
- LM66100DCKR
- TPS630701RNMR
- 100nF
- 47uF
- 1uF
- 47uF
- Place each converter with its own input bypass, inductor, output capacitors and feedback network. Preserve local ground-return paths.
- VCC coil budget: 15 x 6 x 0.17 A = 15.3 A peak. Intended pulses: coil 200 ms; SMA 60 ms; overlap 50 ms; approximately 1 Hz.
sheet 2
- LINGTOUCH  |  04  Drivers  01  08
- REV 2026-10-08  /  CLOUD test CURRENT BASELINE  /  TWO PCB PLACEMENT VARIANTS
- GROUP 01: U1 -> U16 -> U31
- GROUP 02: U2 -> U17 -> U32
- SN74HC595DR
- ULN2003A
- SN74HC595DR
- ULN2003A
- 6-DOT MODULE
- 6-DOT MODULE
- 100nF
- 22uF
- 100nF
- 22uF
- GROUP 03: U3 -> U18 -> U33
- GROUP 04: U4 -> U19 -> U34
- SN74HC595DR
- ULN2003A
- SN74HC595DR
- ULN2003A
- 6-DOT MODULE
- 6-DOT MODULE
- 100nF
- 22uF
- 100nF
- 22uF
- GROUP 05: U5 -> U20 -> U35
- GROUP 06: U6 -> U21 -> U36
- SN74HC595DR
- ULN2003A
- SN74HC595DR
- ULN2003A
- 6-DOT MODULE
- 6-DOT MODULE
- 100nF
- 22uF
- 100nF
- 22uF
- GROUP 07: U7 -> U22 -> U37
- GROUP 08: U8 -> U23 -> U38
- SN74HC595DR
- ULN2003A
- SN74HC595DR
- ULN2003A
- 6-DOT MODULE
- 6-DOT MODULE
- 100nF
- 22uF
- 100nF
- 22uF
sheet 3
- LINGTOUCH  |  05  Drivers  09  16
- REV 2026-10-08  /  CLOUD test CURRENT BASELINE  /  TWO PCB PLACEMENT VARIANTS
- GROUP 09: U9 -> U24 -> U39
- GROUP 10: U10 -> U25 -> U40
- SN74HC595DR
- ULN2003A
- SN74HC595DR
- ULN2003A
- 6-DOT MODULE
- 6-DOT MODULE
- 100nF
- 22uF
- 100nF
- 22uF
- GROUP 11: U11 -> U26 -> U41
- GROUP 12: U12 -> U27 -> U42
- SN74HC595DR
- ULN2003A
- SN74HC595DR
- ULN2003A
- 6-DOT MODULE
- 6-DOT MODULE
- 100nF
- 22uF
- 100nF
- 22uF
- GROUP 13: U13 -> U28 -> U43
- GROUP 14: U14 -> U29 -> U44
- SN74HC595DR
- ULN2003A
- SN74HC595DR
- ULN2003A
- 6-DOT MODULE
- 6-DOT MODULE
- 100nF
- 22uF
- 100nF
- 22uF
- GROUP 15: U15 -> U30 -> U45
- GROUP 16: U46 -> U47 -> U48 / OPTIONAL
- SN74HC595DR
- ULN2003A
- SN74HC595DR
- ULN2003A
- 6-DOT MODULE
- 6-DOT MODULE
- 100nF
- 22uF
- 100nF
- 22uF
sheet 4
- LINGTOUCH  |  01  Input  Charging
- REV 2026-10-08  /  CLOUD test CURRENT BASELINE  /  TWO PCB PLACEMENT VARIANTS
- BATTERY INPUT / REVERSE-POLARITY STAGE
- USB-C 5 V INPUT / CC PULL-DOWNS
- 5.1kΩ
- 5.1kΩ
- WSD30L120DN56
- 100kΩ
- TYPE-C 6P
- 10uF
- 100uF
- 10uF
- 2S CHARGER / IP2326 / 8.3 V, 1 A NOMINAL
- 2.2uH
- 100nF
- 22uF
- 22uF
- 10uF
- 10uF
- 500mΩ
- IP2326
- 10uF
- 100kΩ
- 90kΩ
- 120kΩ
- 120kΩ
- 1kΩ
- 51kΩ
- NTC OPTION / DNP
- 1kΩ
- IN-S63AT5A
- NTC option: default R22 = 51k (temperature sensing disabled). For 100k/B4100 NTC, fit R22 = 82k and connect sensor at J_NTC.
- J3/J4 connect to the external 2S protection board. USB input has no independent system power path. BATM balancing remains unused.
sheet 5
- LINGTOUCH  |  03  Control  ESP
- REV 2026-10-08  /  CLOUD test CURRENT BASELINE  /  TWO PCB PLACEMENT VARIANTS
- ESP32-S3 DEVELOPMENT BOARD / FIXED 25.4 mm ROW SPACING
- HARDWARE ENABLE / BATTERY ADC
- UNDERVOLTAGE HYSTERESIS
- TPS3700DDCR
- SK-12D07-VG 4 NS PA
- TMUX1511PWR
- ESP SOCKET
- ESP SOCKET
- 100nF
- 10kΩ
- 20Ω
- 20Ω
- 20Ω
- 100kΩ
- 39kΩ
- 150kΩ
- 10kΩ
- 47kΩ
- 47kΩ
- 47kΩ
- 100nF
- 100kΩ
- 390kΩ
- 20kΩ
- 0Ω
- 22uF
- 10kΩ
- 10kΩ
- 100kΩ
- 10kΩ
- 100nF
- 1kΩ
- IN-S63AT5A
- TSA06131-250B532CA
- 10nF
- TEST ACCESS / CONTROL SIGNALS
- GPIO9 LOW: outputs disabled.
- GPIO9 HIGH + EN_MAIN HIGH: outputs enabled.
- Firmware: disable -> shift all 16 bytes OFF -> latch -> enable.
- R40/R41/R42: 47k start-up pull-downs.
- J_test is for signal/voltage access; no main-load current.
- U48 / SW1 / J_test retain optional assembly status.
- TEST HEADER
